# Altium project MAX78000.PrjPcb
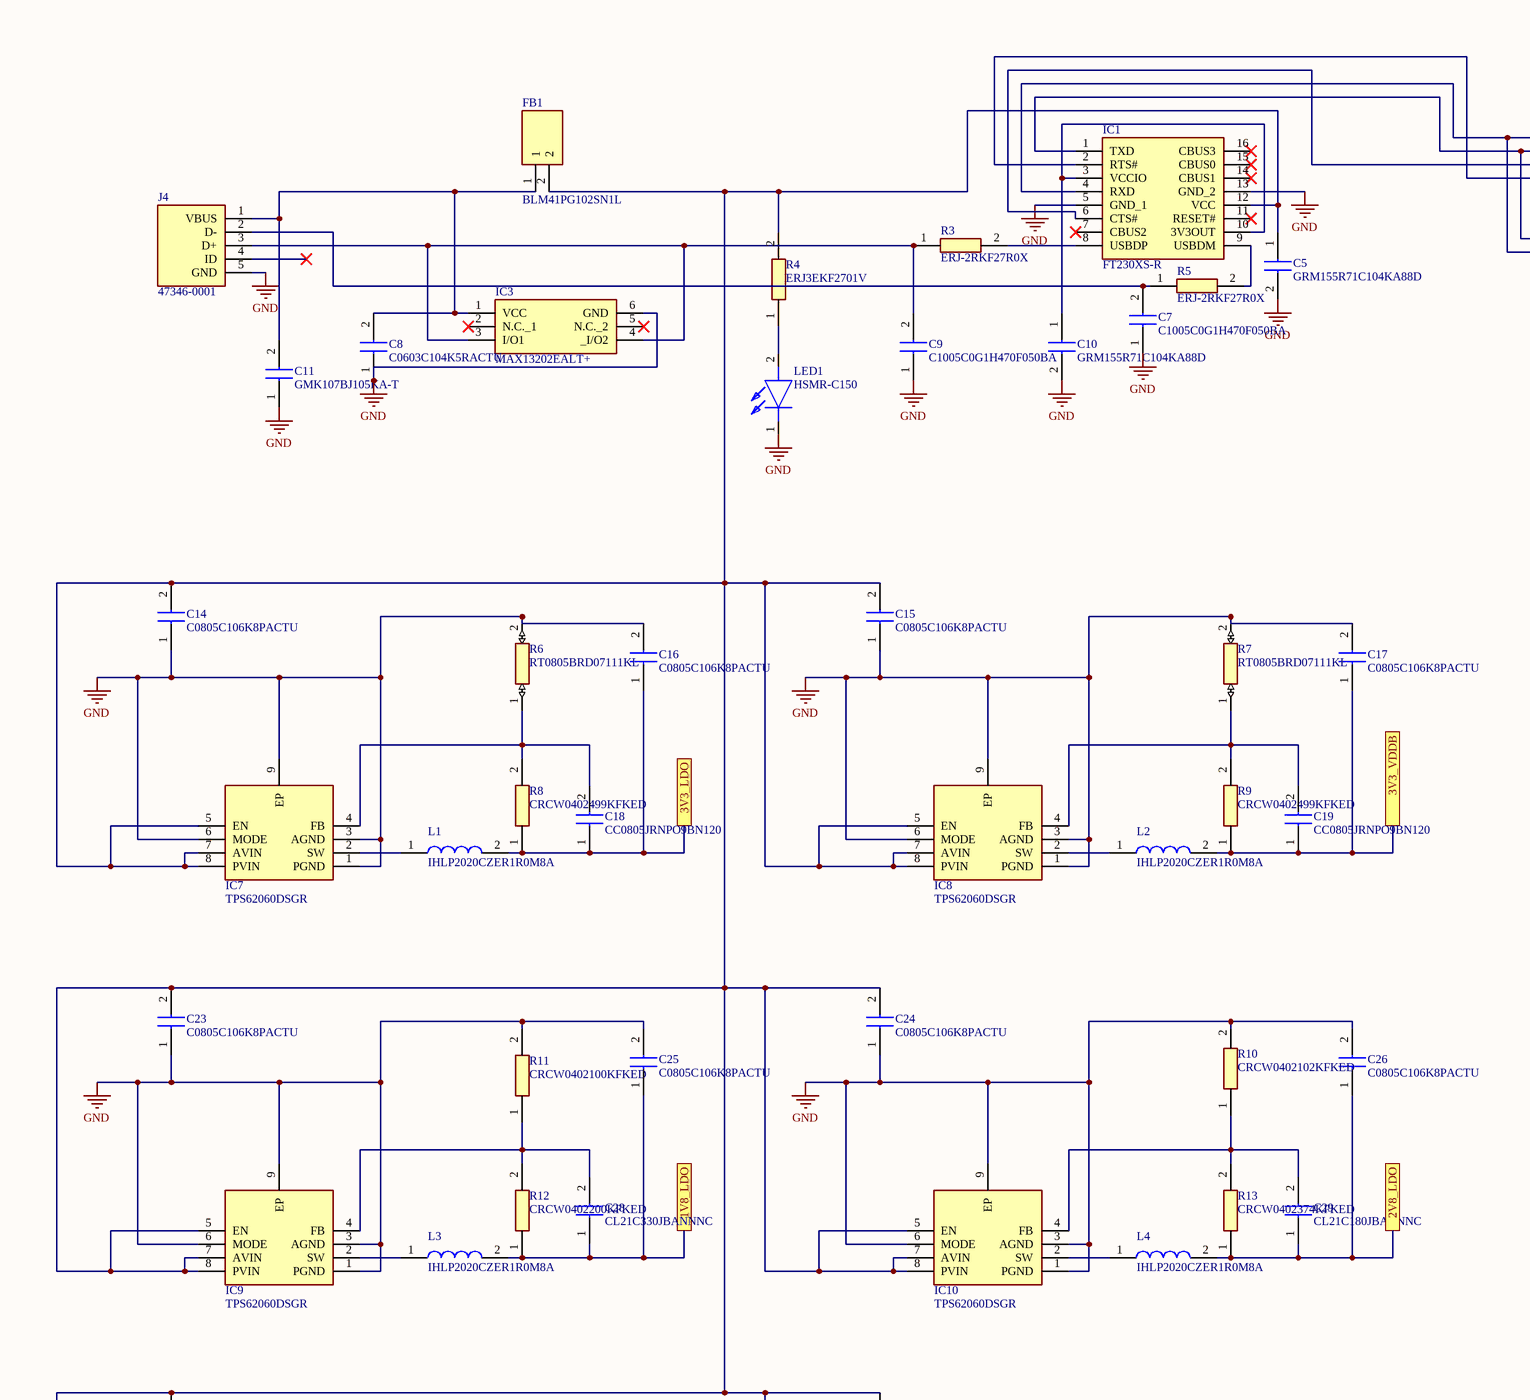
[diagram p0: V1.SchDoc, top left]
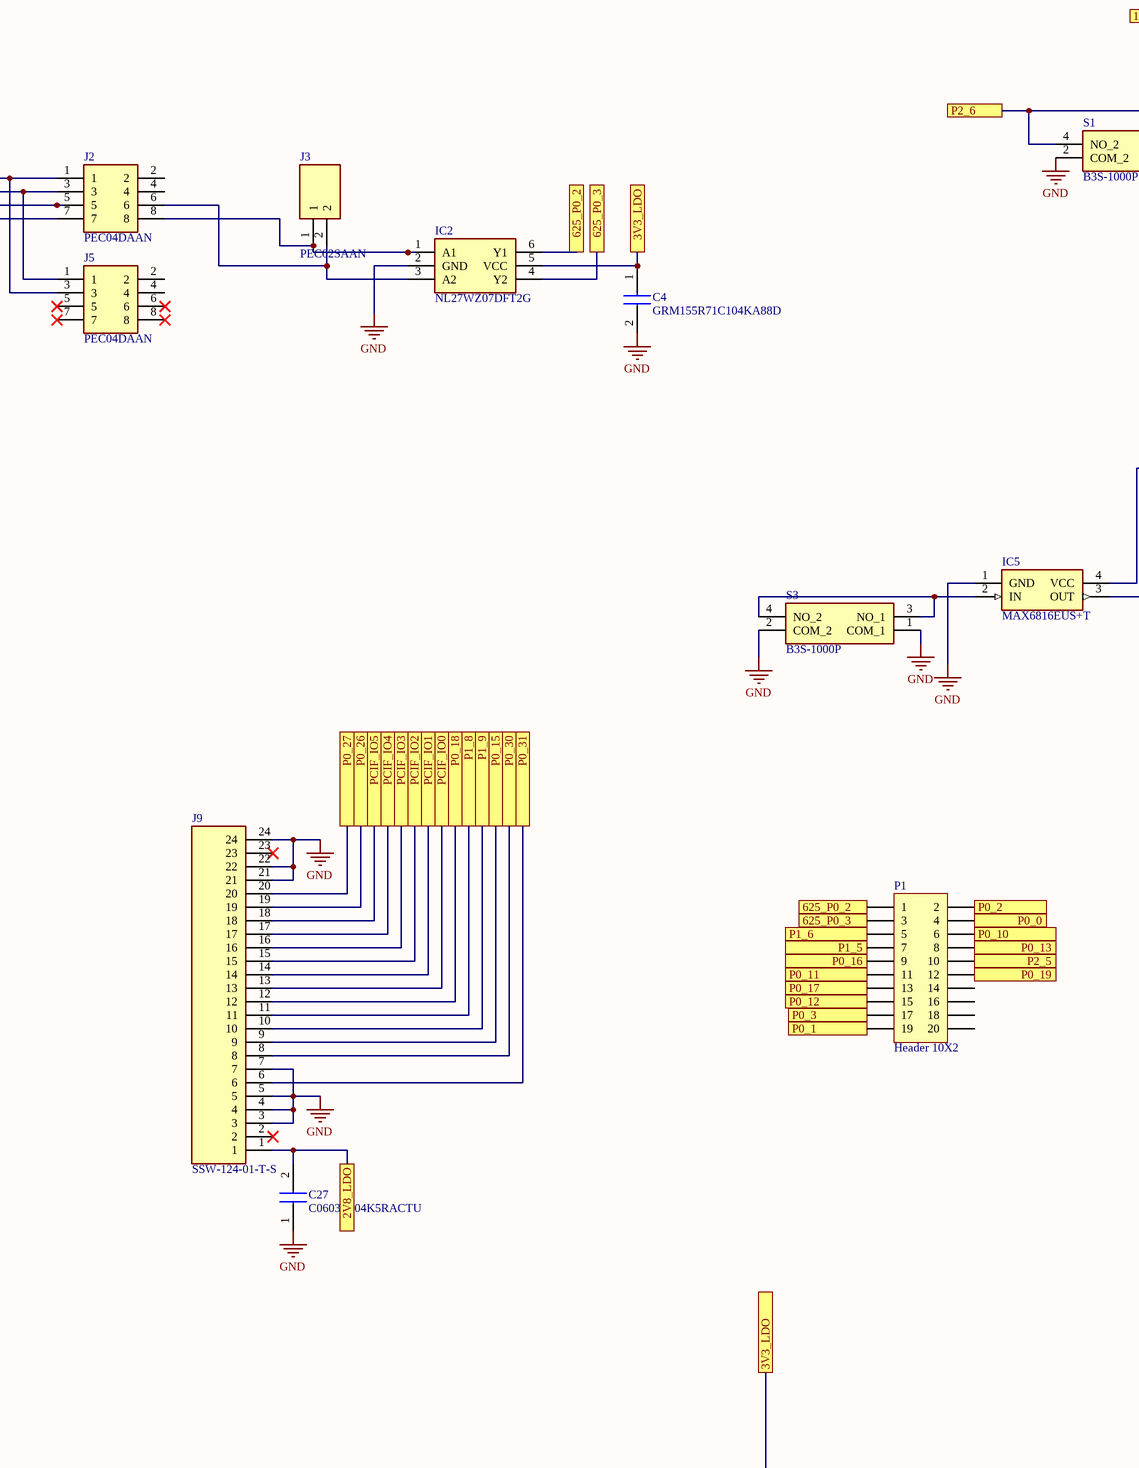
[diagram p1: V1.SchDoc, top middle]
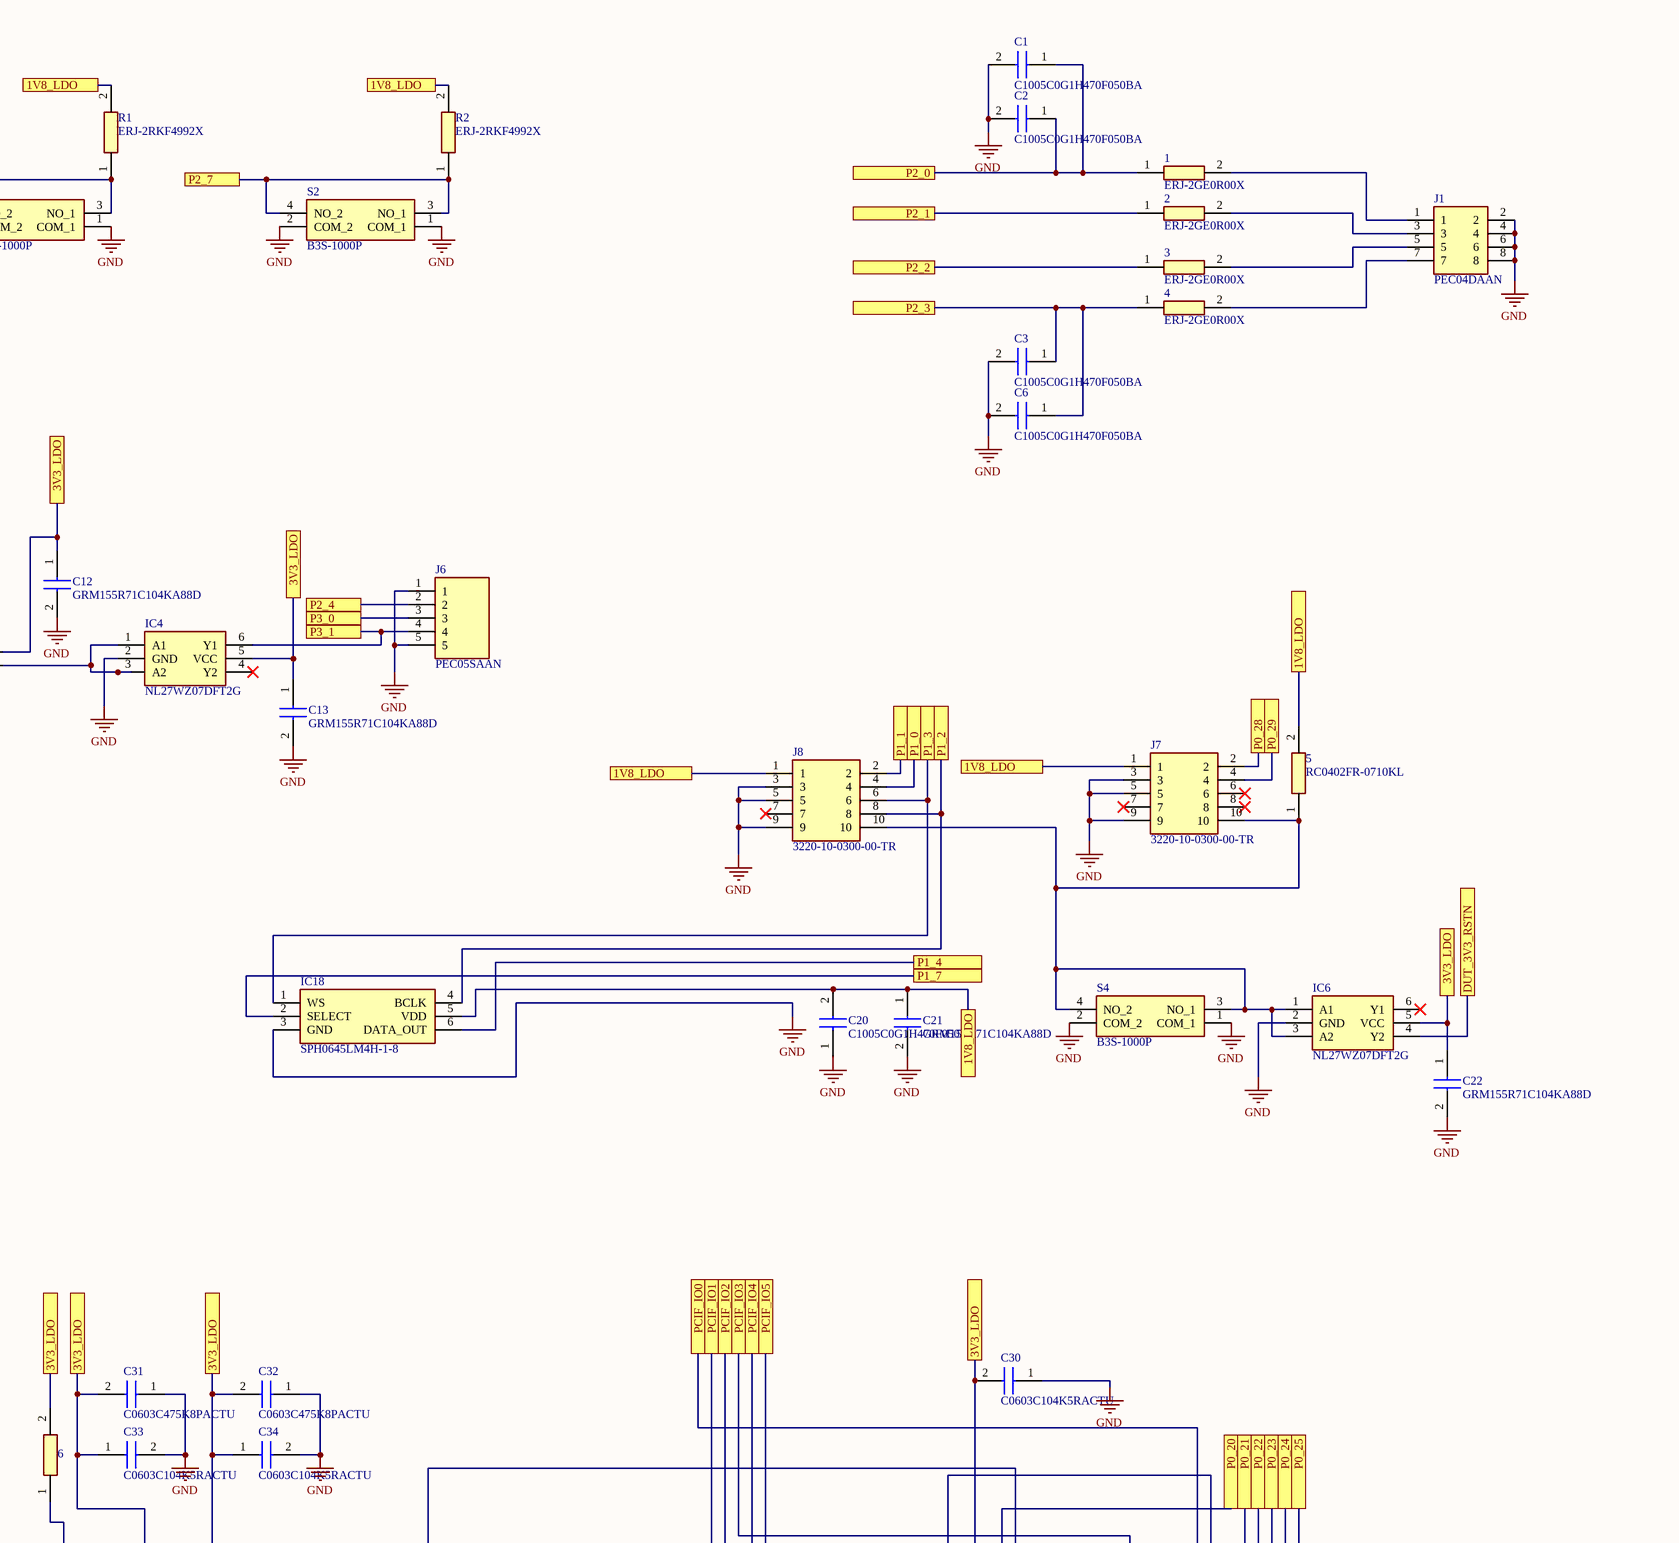
[diagram p2: V1.SchDoc, top right]
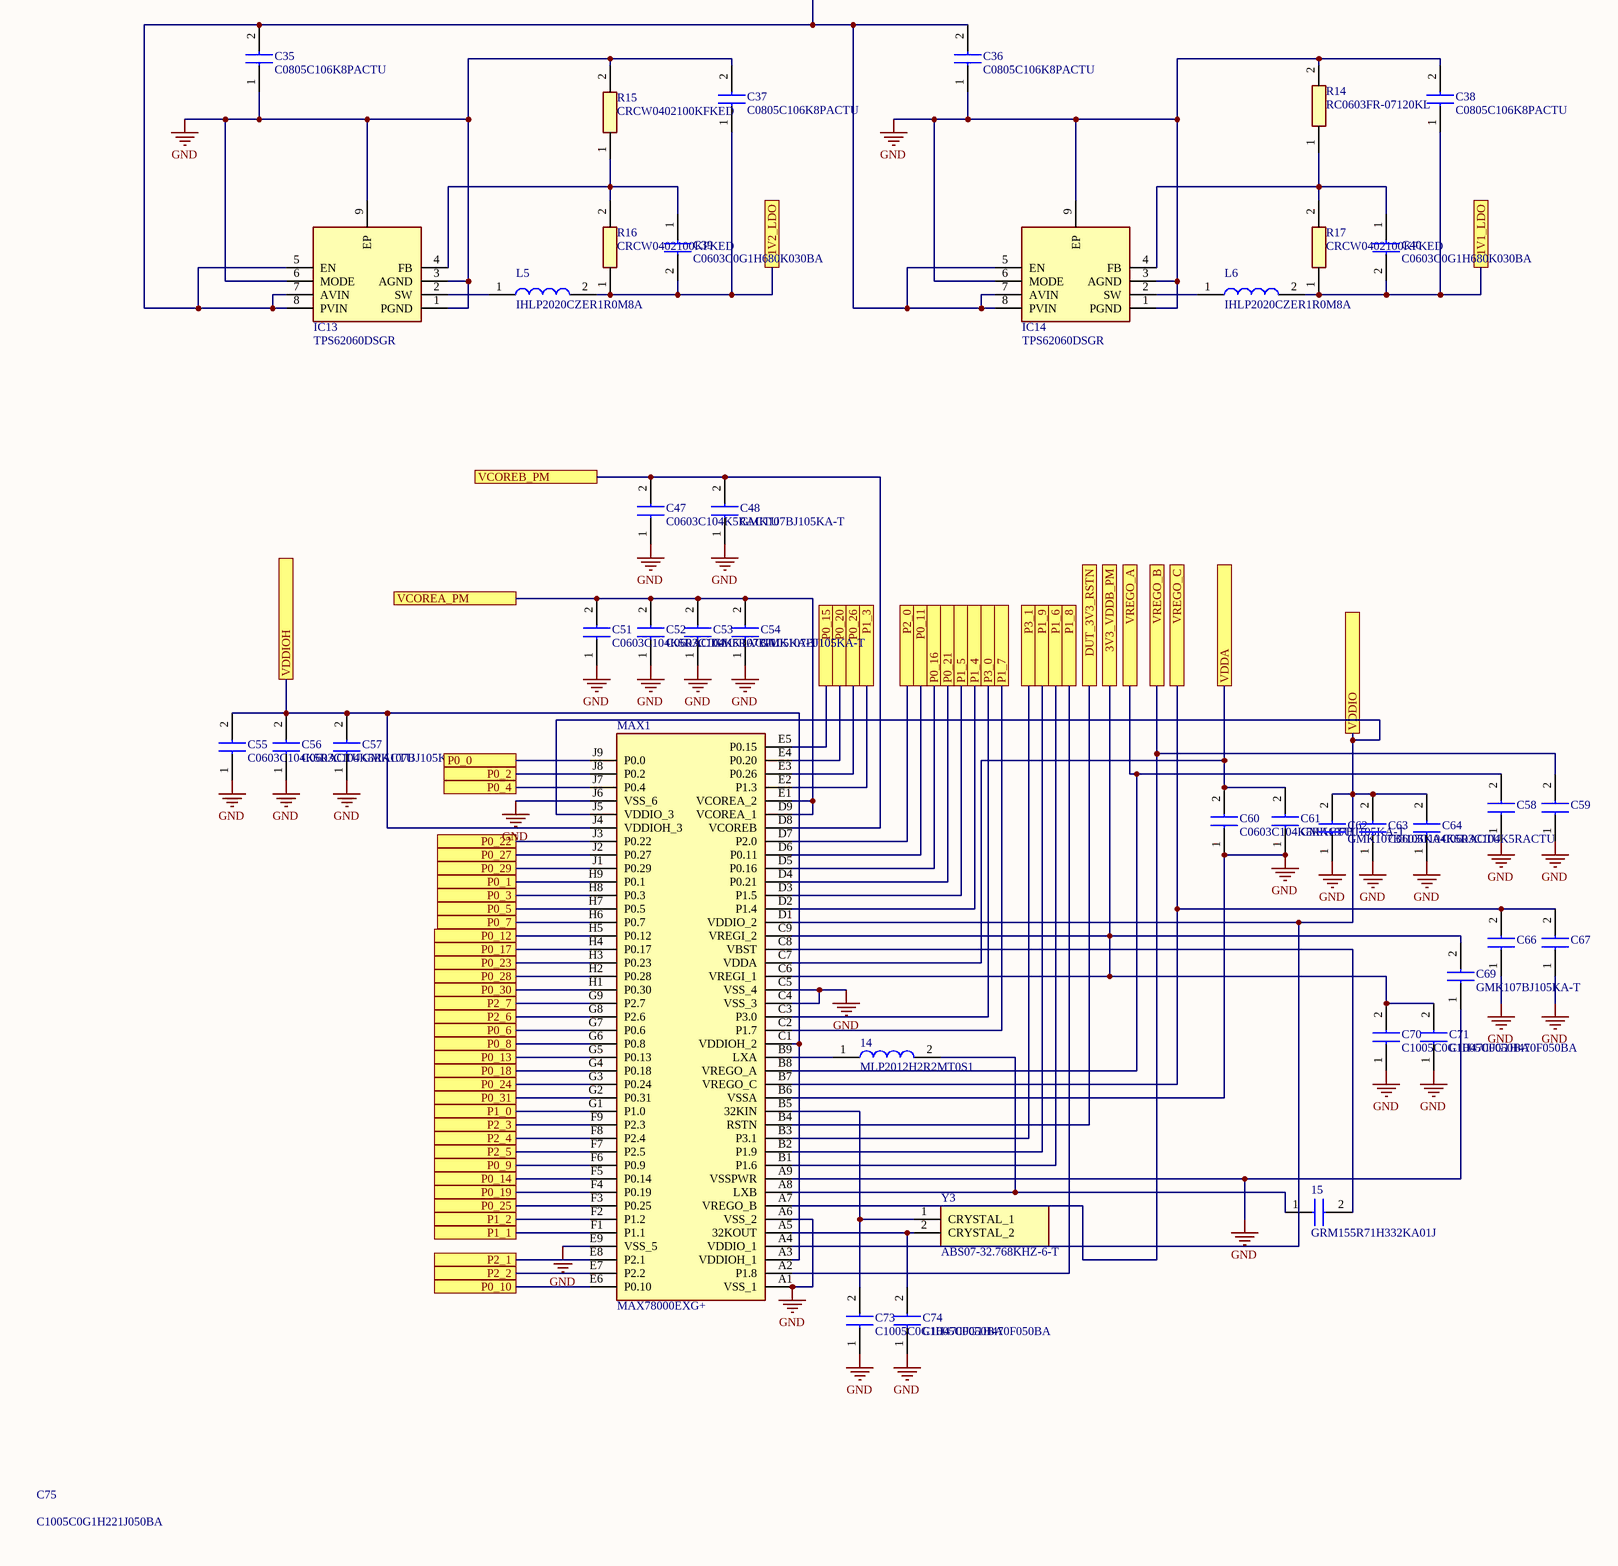
[diagram p3: V1.SchDoc, bottom left]
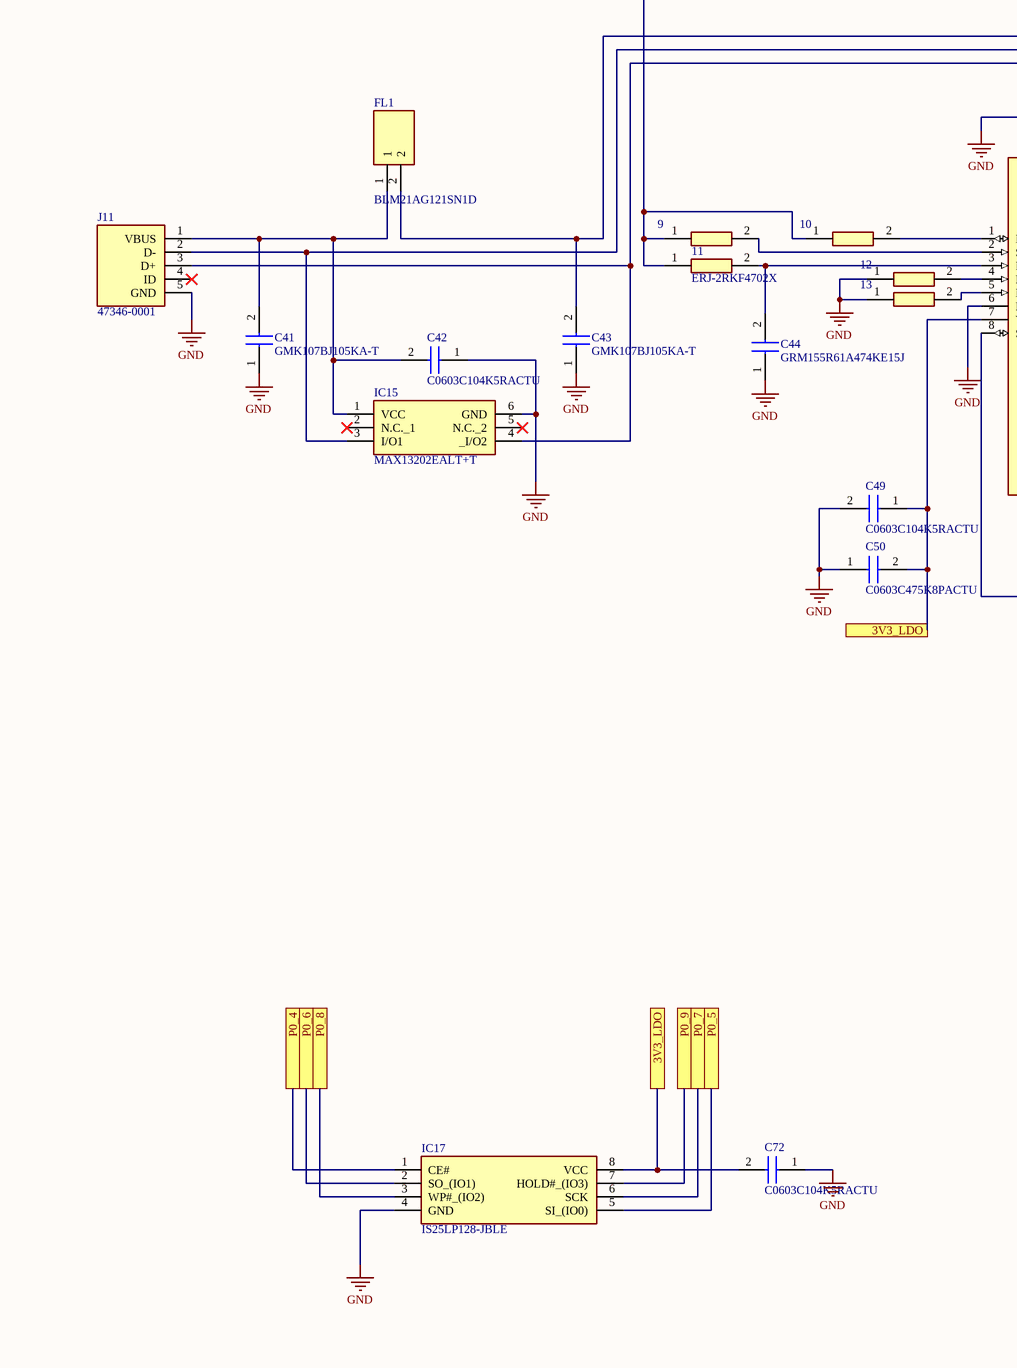
[diagram p4: V1.SchDoc, bottom middle]
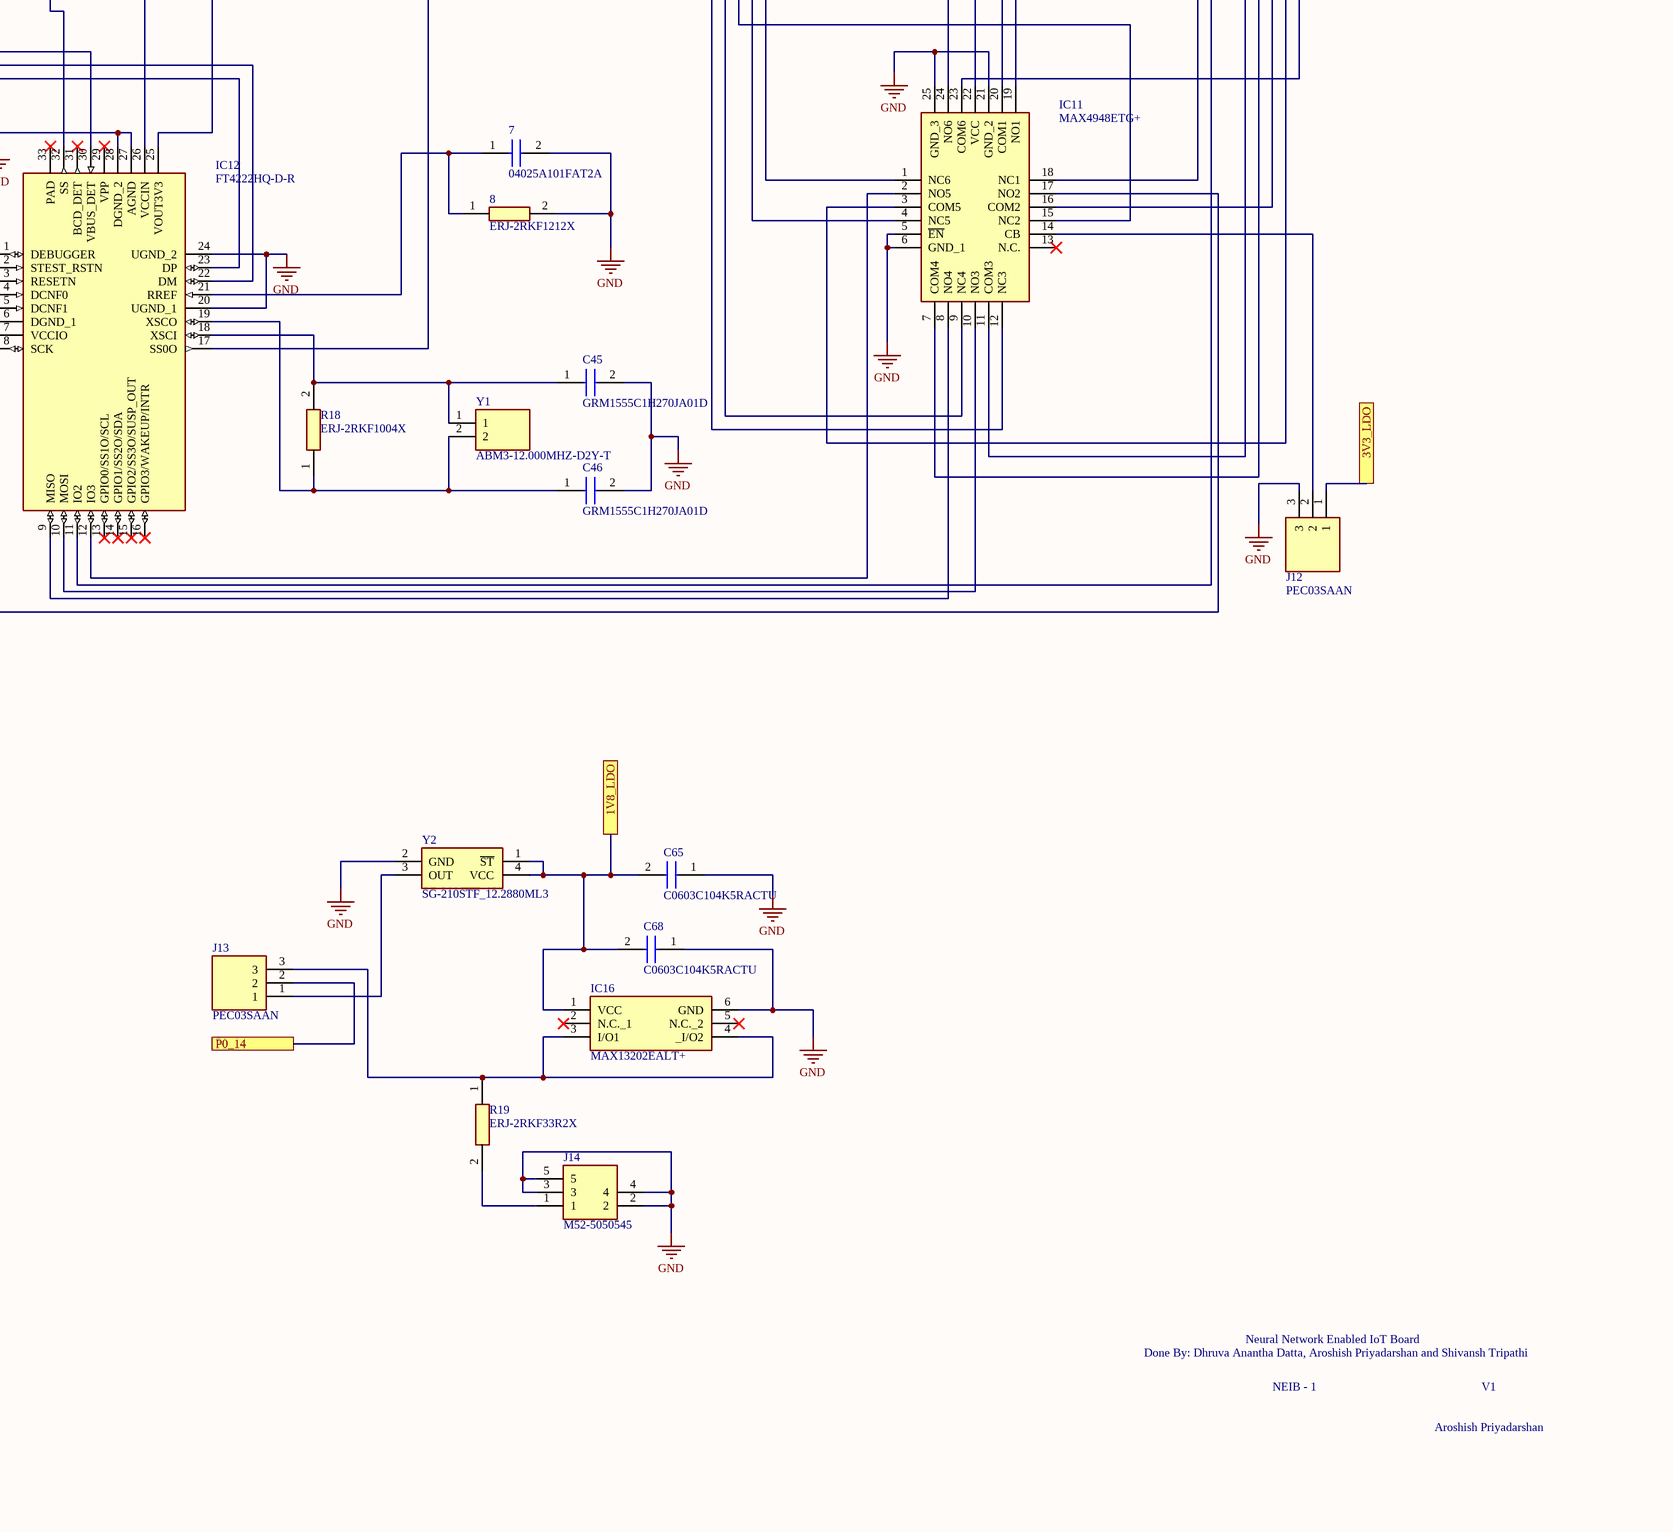
[diagram p5: V1.SchDoc, bottom right]
1 sheet, 158 parts. Net scope: flat (ports and power ports of the same name join across sheets).
Board file: V1.PcbDoc

## Sheet V1.SchDoc
size A1

### Parts
1  ERJ-2GE0R00X  [RESC1005X40N]
2  ERJ-2GE0R00X  [RESC1005X40N]
3  ERJ-2GE0R00X  [RESC1005X40N]
4  ERJ-2GE0R00X  [RESC1005X40N]
5  RC0402FR-0710KL  [RESC1005X40N]
6  RC0402FR-0710KL  [RESC1005X40N]  (value not drawn)
7  04025A101FAT2A  [CAPC1005X56N]
8  ERJ-2RKF1212X  [ERJ2R_(0402)]
9  RC0402FR-0710KL  [RESC1005X40N]  (value not drawn)
10  RC0402FR-0710KL  [RESC1005X40N]  (value not drawn)
11  ERJ-2RKF4702X  [ERJ2R_(0402)]
12  RC0402FR-0710KL  [RESC1005X40N]  (value not drawn)
13  RC0402FR-0710KL  [RESC1005X40N]  (value not drawn)
14  MLP2012H2R2MT0S1  [INDC2012X105N]
15  GRM155R71H332KA01J  [CAPC1005X55N]
C1  C1005C0G1H470F050BA  [C1005_Commercial]
C2  C1005C0G1H470F050BA  [C1005_Commercial]
C3  C1005C0G1H470F050BA  [C1005_Commercial]
C4  GRM155R71C104KA88D  [CAPC1005X55N]
C5  GRM155R71C104KA88D  [CAPC1005X55N]
C6  C1005C0G1H470F050BA  [C1005_Commercial]
C7  C1005C0G1H470F050BA  [C1005_Commercial]
C8  C0603C104K5RACTU  [CAPC1608X95N]
C9  C1005C0G1H470F050BA  [C1005_Commercial]
C10  GRM155R71C104KA88D  [CAPC1005X55N]
C11  GMK107BJ105KA-T  [CAPC1608X90N]
C12  GRM155R71C104KA88D  [CAPC1005X55N]
C13  GRM155R71C104KA88D  [CAPC1005X55N]
C14  C0805C106K8PACTU  [CAPC2012X140N]
C15  C0805C106K8PACTU  [CAPC2012X140N]
C16  C0805C106K8PACTU  [CAPC2012X140N]
C17  C0805C106K8PACTU  [CAPC2012X140N]
C18  CC0805JRNPO9BN120  [CAPC2012X70N]
C19  CC0805JRNPO9BN120  [CAPC2012X70N]
C20  C1005C0G1H470F050BA  [C1005_Commercial]
C21  GRM155R71C104KA88D  [CAPC1005X55N]
C22  GRM155R71C104KA88D  [CAPC1005X55N]
C23  C0805C106K8PACTU  [CAPC2012X140N]
C24  C0805C106K8PACTU  [CAPC2012X140N]
C25  C0805C106K8PACTU  [CAPC2012X140N]
C26  C0805C106K8PACTU  [CAPC2012X140N]
C27  C0603C104K5RACTU  [CAPC1608X95N]
C28  CL21C330JBANNNC  [CAPC2012X75N]
C29  CL21C180JBANNNC  [CAPC2012X135N]
C30  C0603C104K5RACTU  [CAPC1608X95N]
C31  C0603C475K8PACTU  [CAPC1608X85N]
C32  C0603C475K8PACTU  [CAPC1608X85N]
C33  C0603C104K5RACTU  [CAPC1608X95N]
C34  C0603C104K5RACTU  [CAPC1608X95N]
C35  C0805C106K8PACTU  [CAPC2012X140N]
C36  C0805C106K8PACTU  [CAPC2012X140N]
C37  C0805C106K8PACTU  [CAPC2012X140N]
C38  C0805C106K8PACTU  [CAPC2012X140N]
C39  C0603C0G1H680K030BA  [C0603_Commercial]
C40  C0603C0G1H680K030BA  [C0603_Commercial]
C41  GMK107BJ105KA-T  [CAPC1608X90N]
C42  C0603C104K5RACTU  [CAPC1608X95N]
C43  GMK107BJ105KA-T  [CAPC1608X90N]
C44  GRM155R61A474KE15J  [CAPC1005X55N]
C45  GRM1555C1H270JA01D  [CAPC1005X55N]
C46  GRM1555C1H270JA01D  [CAPC1005X55N]
C47  C0603C104K5RACTU  [CAPC1608X95N]
C48  GMK107BJ105KA-T  [CAPC1608X90N]
C49  C0603C104K5RACTU  [CAPC1608X95N]
C50  C0603C475K8PACTU  [CAPC1608X85N]
C51  C0603C104K5RACTU  [CAPC1608X95N]
C52  C0603C104K5RACTU  [CAPC1608X95N]
C53  GMK107BJ105KA-T  [CAPC1608X90N]
C54  GMK107BJ105KA-T  [CAPC1608X90N]
C55  C0603C104K5RACTU  [CAPC1608X95N]
C56  C0603C104K5RACTU  [CAPC1608X95N]
C57  GMK107BJ105KA-T  [CAPC1608X90N]
C58  C1608X5R0J226M080AC  [C1608_Commercial]  (value not drawn)
C59  C1608X5R0J226M080AC  [C1608_Commercial]  (value not drawn)
C60  C0603C104K5RACTU  [CAPC1608X95N]
C61  GMK107BJ105KA-T  [CAPC1608X90N]
C62  GMK107BJ105KA-T  [CAPC1608X90N]
C63  C0603C104K5RACTU  [CAPC1608X95N]
C64  C0603C104K5RACTU  [CAPC1608X95N]
C65  C0603C104K5RACTU  [CAPC1608X95N]
C66  C1608X5R0J226M080AC  [C1608_Commercial]  (value not drawn)
C67  C1608X5R0J226M080AC  [C1608_Commercial]  (value not drawn)
C68  C0603C104K5RACTU  [CAPC1608X95N]
C69  GMK107BJ105KA-T  [CAPC1608X90N]
C70  C1005C0G1H470F050BA  [C1005_Commercial]
C71  C1005C0G1H470F050BA  [C1005_Commercial]
C72  C0603C104K5RACTU  [CAPC1608X95N]
C73  C1005C0G1H470F050BA  [C1005_Commercial]
C74  C1005C0G1H470F050BA  [C1005_Commercial]
C75  C1005C0G1H221J050BA  [C1005_Commercial]
FB1  BLM41PG102SN1L  [BLM41PG102SH1L]
FL1  BLM21AG121SN1D  [BLM21AG102BH1J]
IC1  FT230XS-R  [SOP64P599X175-16N]
IC2  NL27WZ07DFT2G  [SOT65P210X110-6N]
IC3  MAX13202EALT+  [MAX13202EALT]
IC4  NL27WZ07DFT2G  [SOT65P210X110-6N]
IC5  MAX6816EUS+T  [MAX812REUST]
IC6  NL27WZ07DFT2G  [SOT65P210X110-6N]
IC7  TPS62060DSGR  [SON50P200X200X80-9N]
IC8  TPS62060DSGR  [SON50P200X200X80-9N]
IC9  TPS62060DSGR  [SON50P200X200X80-9N]
IC10  TPS62060DSGR  [SON50P200X200X80-9N]
IC11  MAX4948ETG+  [QFN50P400X400X80-25N]
IC12  FT4222HQ-D-R  [QFN50P500X500X90-33N]
IC13  TPS62060DSGR  [SON50P200X200X80-9N]
IC14  TPS62060DSGR  [SON50P200X200X80-9N]
IC15  MAX13202EALT+T  [MAX13202EALTT]
IC16  MAX13202EALT+  [MAX13202EALT]
IC17  IS25LP128-JBLE  [SOIC127P790X216-8N]
IC18  SPH0645LM4H-1-8  [SPH0645LM4H18]
J1  PEC04DAAN  [HDRV8W64P254_2X4_1016X508X838P]
J2  PEC04DAAN  [HDRV8W64P254_2X4_1016X508X838P]
J3  PEC02SAAN  [HDRV2W64P0X254_1X2_508X254X838P]
J4  47346-0001  [usb conn]
J5  PEC04DAAN  [HDRV8W64P254_2X4_1016X508X838P]
J6  PEC05SAAN  [HDRV5W64P0X254_1X5_1270X254X858P]
J7  3220-10-0300-00-TR  [322010030000TR]
J8  3220-10-0300-00-TR  [322010030000TR]
J9  SSW-124-01-T-S  [SAMTEC_SSW-124-01-T-S]
J11  47346-0001  [usb conn]
J12  PEC03SAAN  [HDRV3W64P0X254_1X3_762X254X838P]
J13  PEC03SAAN  [HDRV3W64P0X254_1X3_762X254X838P]
J14  M52-5050545  [M525050545]
L1  IHLP2020CZER1R0M8A  [INDPM5552X300N]
L2  IHLP2020CZER1R0M8A  [INDPM5552X300N]
L3  IHLP2020CZER1R0M8A  [INDPM5552X300N]
L4  IHLP2020CZER1R0M8A  [INDPM5552X300N]
L5  IHLP2020CZER1R0M8A  [INDPM5552X300N]
L6  IHLP2020CZER1R0M8A  [INDPM5552X300N]
LED1  HSMR-C150  [LEDC3216X120N]
MAX1  MAX78000EXG+  [max78000]
P1  Header 10X2  [HDR2X10]
R1  ERJ-2RKF4992X  [ERJ2R_(0402)]
R2  ERJ-2RKF4992X  [ERJ2R_(0402)]
R3  ERJ-2RKF27R0X  [ERJ2R_(0402)]
R4  ERJ3EKF2701V  [ERJ3EK_(0603)]
R5  ERJ-2RKF27R0X  [ERJ2R_(0402)]
R6  RT0805BRD07111KL  [RESC2012X60N]
R7  RT0805BRD07111KL  [RESC2012X60N]
R8  CRCW0402499KFKED  [RESC1005X40N]
R9  CRCW0402499KFKED  [RESC1005X40N]
R10  CRCW0402102KFKED  [RESC1005X40N]
R11  CRCW0402100KFKED  [RESC1005X40N]
R12  CRCW0402200KFKED  [RESC1005X40N]
R13  CRCW0402374KFKED  [RESC1005X40N]
R14  RC0603FR-07120KL  [RESC1608X55N]
R15  CRCW0402100KFKED  [RESC1005X40N]
R16  CRCW0402100KFKED  [RESC1005X40N]
R17  CRCW0402100KFKED  [RESC1005X40N]
R18  ERJ-2RKF1004X  [ERJ2R_(0402)]
R19  ERJ-2RKF33R2X  [ERJ2R_(0402)]
S1  B3S-1000P  [B3S1000P]
S2  B3S-1000P  [B3S1000P]
S3  B3S-1000P  [B3S1000P]
S4  B3S-1000P  [B3S1000P]
Y1  ABM3-12.000MHZ-D2Y-T  [ABM38000MHzD2YT]
Y2  SG-210STF_12.2880ML3  [SG210STF122880ML3]
Y3  ABS07-32.768KHZ-6-T  [ABS0732768KHZ6T]

### Ports
1V1_LDO, 1V2_LDO, 1V8_LDO, 2V8_LDO, 3V3_LDO, 3V3_VDDB, 3V3_VDDB_PM, 625_P0_2, 625_P0_3, DUT_3V3_RSTN, P0_0, P0_1, P0_2, P0_3, P0_4, P0_5, P0_6, P0_7, P0_8, P0_9, P0_10, P0_11, P0_12, P0_13, P0_14, P0_15, P0_16, P0_17, P0_18, P0_19, P0_20, P0_21, P0_22, P0_23, P0_24, P0_25, P0_26, P0_27, P0_28, P0_29, P0_30, P0_31, P1_0, P1_1, P1_2, P1_3, P1_4, P1_5, P1_6, P1_7, P1_8, P1_9, P2_0, P2_1, P2_2, P2_3, P2_4, P2_5, P2_6, P2_7, P3_0, P3_1, PCIF_IO0, PCIF_IO1, PCIF_IO2, PCIF_IO3, PCIF_IO4, PCIF_IO5, VCOREA_PM, VCOREB_PM, VDDA, VDDIO, VDDIOH, VREGO_A, VREGO_B, VREGO_C

### Nets
GND: 7.2 8.2 12.1 13.1 C1.2 C2.2 C3.2 C4.2 C5.2 C6.2 C7.1 C8.1 C9.1 C10.2 C11.1 C12.2 C13.2 C14.1 C15.1 C16.2 C17.2 C20.1 C21.2 C22.2 C23.1 C24.1 C25.2 C26.2 C27.1 C30.1 C31.1(C1) C32.1(C1) C33.2 C34.2 C35.1 C36.1 C37.2 C38.2 C41.1 C42.1 C43.1 C44.1 C45.2 C46.2 C47.1 C48.1 C49.2 C50.1(C1) C51.1 C52.1 C53.1 C54.1 C55.1 C56.1 C57.1 C58.1 C59.1 C60.1 C61.1 C62.1 C63.1 C64.1 C65.1 C66.1 C67.1 C68.1 C69.1 C70.1 C71.1 C72.1 C73.1 C74.1 IC1.5(GND_1) IC1.13(GND_2) IC2.2(GND) IC3.6(GND) IC4.2(GND) IC5.1(GND) IC6.2(GND) IC7.1(PGND) IC7.3(AGND) IC7.6(MODE) IC7.9(EP) IC8.1(PGND) IC8.3(AGND) IC8.6(MODE) IC8.9(EP) IC9.1(PGND) IC9.3(AGND) IC9.6(MODE) IC9.9(EP) IC10.1(PGND) IC10.3(AGND) IC10.6(MODE) IC10.9(EP) IC11.5(~{EN}) IC11.6(GND_1) IC11.21(GND_2) IC11.25(GND_3) IC12.6(DGND_1) IC12.20(UGND_1) IC12.24(UGND_2) IC12.27(AGND) IC12.28(DGND_2) IC13.1(PGND) IC13.3(AGND) IC13.6(MODE) IC13.9(EP) IC14.1(PGND) IC14.3(AGND) IC14.6(MODE) IC14.9(EP) IC15.6(GND) IC16.6(GND) IC17.4(GND) IC18.3(GND) J1.2 J1.4 J1.6 J1.8 J4.5(GND) J6.1 J6.5 J7.3 J7.5 J7.9 J8.3 J8.5 J8.9 J9.3 J9.4 J9.5 J9.7 J9.21 J9.22 J9.24 J11.5(GND) J12.3 J14.2 J14.3 J14.4 J14.5 LED1.1(K) MAX1.A1(VSS_1) MAX1.A6(VSS_2) MAX1.A9(VSSPWR) MAX1.B6(VSSA) MAX1.C4(VSS_3) MAX1.C5(VSS_4) MAX1.E9(VSS_5) MAX1.J6(VSS_6) R6.2 R7.2 R10.2 R11.2 R14.2 R15.2 S1.1(COM_1) S1.2(COM_2) S2.1(COM_1) S2.2(COM_2) S3.1(COM_1) S3.2(COM_2) S4.1(COM_1) S4.2(COM_2) Y2.2(GND)
Net1_1: 1.1 C1.1 C2.1 MAX1.D7(P2.0) ; port P2_0
Net1_2: 1.2 J1.1
Net2_1: 2.1 MAX1.E8(P2.1) ; port P2_1
Net2_2: 2.2 J1.3
Net3_1: 3.1 MAX1.E7(P2.2) ; port P2_2
Net3_2: 3.2 J1.5
Net4_1: 4.1 C3.1 C6.1 MAX1.F9(P2.3) ; port P2_3
Net4_2: 4.2 J1.7
Net5_1: 5.1 IC6.1(A1) IC6.3(A2) J7.10 J8.10 S4.3(NO_1) S4.4(NO_2)
Net5_2: 5.2 C20.2 C21.1 C25.1 C28.1 C65.2 C68.2 IC16.1(VCC) IC18.5(VDD) J7.1 J8.1 L3.2 R1.2 R2.2 R12.1 Y2.1(~{ST}) Y2.4(VCC) ; port 1V8_LDO
Net6_1: 6.1 IC12.32(SS)
Net6_2: 6.2 9.1 10.1 11.1 C4.1 C12.1 C13.1 C16.1 C18.1 C22.1 C30.2 C31.2(C2) C32.2(C2) C33.1 C34.1 C49.1 C50.2(C2) C72.2 IC2.5(VCC) IC4.5(VCC) IC5.4(VCC) IC6.5(VCC) IC11.22(VCC) IC12.7(VCCIO) IC12.25(VOUT3V3) IC12.26(VCCIN) IC17.8(VCC) J12.1 L1.2 R8.1 ; port 3V3_LDO
Net7_1: 7.1 8.1 IC12.21(RREF)
Net9_2: 9.2 IC12.2(STEST_RSTN)
Net10_2: 10.2 IC12.1(DEBUGGER)
Net11_2: 11.2 C44.2 IC12.3(RESETN)
Net12_2: 12.2 IC12.4(DCNF0)
Net13_2: 13.2 IC12.5(DCNF1)
Net14_1: 14.1 MAX1.B9(LXA)
Net14_2: 14.2 15.1 MAX1.A8(LXB)
Net15_2: 15.2 MAX1.C8(VBST)
NetC5_1: C5.1 C14.2 C15.2 C23.2 C24.2 C35.2 C36.2 FB1.2 IC1.12(VCC) IC7.5(EN) IC7.7(AVIN) IC7.8(PVIN) IC8.5(EN) IC8.7(AVIN) IC8.8(PVIN) IC9.5(EN) IC9.7(AVIN) IC9.8(PVIN) IC10.5(EN) IC10.7(AVIN) IC10.8(PVIN) IC13.5(EN) IC13.7(AVIN) IC13.8(PVIN) IC14.5(EN) IC14.7(AVIN) IC14.8(PVIN) R4.2
NetC7_2: C7.2 J4.2(D-) R5.1
NetC8_2: C8.2 C11.2 FB1.1 IC3.1(VCC) J4.1(VBUS)
NetC9_2: C9.2 IC3.3(I/O1) IC3.4(_I/O2) J4.3(D+) R3.1
NetC10_1: C10.1 IC1.3(VCCIO) IC1.10(3V3OUT)
NetC17_1: C17.1 C19.1 L2.2 R9.1 ; port 3V3_VDDB
NetC18_2: C18.2 IC7.4(FB) R6.1 R8.2
NetC19_2: C19.2 IC8.4(FB) R7.1 R9.2
NetC26_1: C26.1 C27.2 C29.1 J9.1 L4.2 R13.1 ; port 2V8_LDO
NetC28_2: C28.2 IC9.4(FB) R11.1 R12.2
NetC29_2: C29.2 IC10.4(FB) R10.1 R13.2
NetC37_1: C37.1 C39.2 L5.2 R16.1 ; port 1V2_LDO
NetC38_1: C38.1 C40.2 L6.2 R17.1 ; port 1V1_LDO
NetC39_1: C39.1 IC13.4(FB) R15.1 R16.2
NetC40_1: C40.1 IC14.4(FB) R14.1 R17.2
NetC41_2: C41.2 C42.2 FL1.1 IC15.1(VCC) J11.1(VBUS)
NetC43_2: C43.2 FL1.2 IC12.30(VBUS_DET)
NetC45_1: C45.1 IC12.18(XSCI) R18.2 Y1.1
NetC46_1: C46.1 IC12.19(XSCO) R18.1 Y1.2
NetC47_2: C47.2 C48.2 MAX1.D8(VCOREB) ; port VCOREB_PM
NetC51_2: C51.2 C52.2 C53.2 C54.2 MAX1.D9(VCOREA_1) MAX1.E1(VCOREA_2) ; port VCOREA_PM
NetC55_2: C55.2 C56.2 C57.2 MAX1.A3(VDDIOH_1) MAX1.C1(VDDIOH_2) MAX1.J4(VDDIOH_3) ; port VDDIOH
NetC58_2: C58.2 MAX1.B8(VREGO_A) ; port VREGO_A
NetC59_2: C59.2 MAX1.A7(VREGO_B) ; port VREGO_B
NetC60_2: C60.2 C61.2 MAX1.C7(VDDA) ; port VDDA
NetC62_2: C62.2 C63.2 C64.2 MAX1.A4(VDDIO_1) MAX1.D1(VDDIO_2) MAX1.J5(VDDIO_3) ; port VDDIO
NetC66_2: C66.2 C67.2 MAX1.B7(VREGO_C) ; port VREGO_C
NetC69_2: C69.2 C70.2 C71.2 MAX1.C6(VREGI_1) MAX1.C9(VREGI_2) ; port 3V3_VDDB_PM
NetC73_2: C73.2 MAX1.B5(32KIN) Y3.1(CRYSTAL_1)
NetC74_2: C74.2 MAX1.A5(32KOUT) Y3.2(CRYSTAL_2)
NetIC1_1: IC1.1(TXD) J2.3 J5.1
NetIC1_2: IC1.2(RTS#) J2.7
NetIC1_4: IC1.4(RXD) J2.1 J5.3
NetIC1_6: IC1.6(CTS#) J2.5
NetIC1_8: IC1.8(USBDP) R3.2
NetIC1_9: IC1.9(USBDM) R5.2
NetIC2_1: IC2.1(A1) J2.8 J3.1
NetIC2_3: IC2.3(A2) J2.6 J3.2
NetIC2_4: IC2.4(Y2) P1.3 ; port 625_P0_3
NetIC2_6: IC2.6(Y1) P1.1 ; port 625_P0_2
NetIC4_1: IC4.1(A1) IC4.3(A2) IC5.3(OUT)
NetIC4_6: IC4.6(Y1) J6.4 MAX1.B3(P3.1) ; port P3_1
NetIC5_2: IC5.2(IN) S3.3(NO_1) S3.4(NO_2)
NetIC6_4: IC6.4(Y2) MAX1.B4(RSTN) ; port DUT_3V3_RSTN
NetIC7_2: IC7.2(SW) L1.1
NetIC8_2: IC8.2(SW) L2.1
NetIC9_2: IC9.2(SW) L3.1
NetIC10_2: IC10.2(SW) L4.1
NetIC11_1: IC11.1(NC6) J9.18 ; port PCIF_IO5
NetIC11_2: IC11.2(NO5) IC12.12(IO3)
NetIC11_3: IC11.3(COM5) MAX1.G3(P0.24) ; port P0_24
NetIC11_4: IC11.4(NC5) J9.17 ; port PCIF_IO4
NetIC11_7: IC11.7(COM4) MAX1.J3(P0.22) ; port P0_22
NetIC11_8: IC11.8(NO4) IC12.9(MISO)
NetIC11_9: IC11.9(NC4) J9.15 ; port PCIF_IO2
NetIC11_10: IC11.10(NO3) IC12.10(MOSI)
NetIC11_11: IC11.11(COM3) MAX1.D4(P0.21) ; port P0_21
NetIC11_12: IC11.12(NC3) J9.14 ; port PCIF_IO1
NetIC11_14: IC11.14(CB) J12.2
NetIC11_15: IC11.15(NC2) J9.16 ; port PCIF_IO3
NetIC11_16: IC11.16(COM2) MAX1.H3(P0.23) ; port P0_23
NetIC11_17: IC11.17(NO2) IC12.8(SCK)
NetIC11_18: IC11.18(NC1) J9.13 ; port PCIF_IO0
NetIC11_19: IC11.19(NO1) IC12.17(SS0O)
NetIC11_20: IC11.20(COM1) MAX1.E4(P0.20) ; port P0_20
NetIC11_23: IC11.23(COM6) MAX1.F3(P0.25) ; port P0_25
NetIC11_24: IC11.24(NO6) IC12.11(IO2)
NetIC12_22: IC12.22(DM) IC15.3(I/O1) J11.2(D-)
NetIC12_23: IC12.23(DP) IC15.4(_I/O2) J11.3(D+)
NetIC13_2: IC13.2(SW) L5.1
NetIC14_2: IC14.2(SW) L6.1
NetIC16_3: IC16.3(I/O1) IC16.4(_I/O2) J13.3 R19.1
NetIC17_1: IC17.1(CE#) MAX1.J7(P0.4) ; port P0_4
NetIC17_2: IC17.2(SO_(IO1)) MAX1.G7(P0.6) ; port P0_6
NetIC17_3: IC17.3(WP#_(IO2)) MAX1.G6(P0.8) ; port P0_8
NetIC17_5: IC17.5(SI_(IO0)) MAX1.H7(P0.5) ; port P0_5
NetIC17_6: IC17.6(SCK) MAX1.H6(P0.7) ; port P0_7
NetIC17_7: IC17.7(HOLD#_(IO3)) MAX1.F6(P0.9) ; port P0_9
NetIC18_1: IC18.1(WS) J8.6 MAX1.E2(P1.3) ; port P1_3
NetIC18_2: IC18.2(SELECT) MAX1.C2(P1.7) ; port P1_7
NetIC18_4: IC18.4(BCLK) J8.8 MAX1.F2(P1.2) ; port P1_2
NetIC18_6: IC18.6(DATA_OUT) MAX1.D2(P1.4) ; port P1_4
NetJ6_2: J6.2 MAX1.F8(P2.4) ; port P2_4
NetJ6_3: J6.3 MAX1.C3(P3.0) ; port P3_0
NetJ7_2: J7.2 MAX1.H2(P0.28) ; port P0_28
NetJ7_4: J7.4 MAX1.J1(P0.29) ; port P0_29
NetJ8_2: J8.2 MAX1.F1(P1.1) ; port P1_1
NetJ8_4: J8.4 MAX1.G1(P1.0) ; port P1_0
NetJ9_6: J9.6 MAX1.G2(P0.31) ; port P0_31
NetJ9_8: J9.8 MAX1.H1(P0.30) ; port P0_30
NetJ9_9: J9.9 MAX1.E5(P0.15) ; port P0_15
NetJ9_10: J9.10 MAX1.B2(P1.9) ; port P1_9
NetJ9_11: J9.11 MAX1.A2(P1.8) ; port P1_8
NetJ9_12: J9.12 MAX1.G4(P0.18) ; port P0_18
NetJ9_19: J9.19 MAX1.E3(P0.26) ; port P0_26
NetJ9_20: J9.20 MAX1.J2(P0.27) ; port P0_27
NetJ13_1: J13.1 Y2.3(OUT)
NetJ13_2: J13.2 MAX1.F5(P0.14) ; port P0_14
NetJ14_1: J14.1 R19.2
NetLED1_2: LED1.2(A) R4.1
NetMAX1_B1: MAX1.B1(P1.6) P1.5 ; port P1_6
NetMAX1_D3: MAX1.D3(P1.5) P1.7 ; port P1_5
NetMAX1_D5: MAX1.D5(P0.16) P1.9 ; port P0_16
NetMAX1_D6: MAX1.D6(P0.11) P1.11 ; port P0_11
NetMAX1_E6: MAX1.E6(P0.10) P1.6 ; port P0_10
NetMAX1_F4: MAX1.F4(P0.19) P1.12 ; port P0_19
NetMAX1_F7: MAX1.F7(P2.5) P1.10 ; port P2_5
NetMAX1_G5: MAX1.G5(P0.13) P1.8 ; port P0_13
NetMAX1_G8: MAX1.G8(P2.6) R1.1 S1.3(NO_1) S1.4(NO_2) ; port P2_6
NetMAX1_G9: MAX1.G9(P2.7) R2.1 S2.3(NO_1) S2.4(NO_2) ; port P2_7
NetMAX1_H4: MAX1.H4(P0.17) P1.13 ; port P0_17
NetMAX1_H5: MAX1.H5(P0.12) P1.15 ; port P0_12
NetMAX1_H8: MAX1.H8(P0.3) P1.17 ; port P0_3
NetMAX1_H9: MAX1.H9(P0.1) P1.19 ; port P0_1
NetMAX1_J8: MAX1.J8(P0.2) P1.2 ; port P0_2
NetMAX1_J9: MAX1.J9(P0.0) P1.4 ; port P0_0

Not connected (* = marked no-connect by the designer): IC1 7(CBUS2)* 11(RESET#)* 14(CBUS1)* 15(CBUS0)* 16(CBUS3)*; IC3 2(N.C._1)* 5(N.C._2)*; IC4 4(Y2)*; IC6 6(Y1)*; IC11 13(N.C.)*; IC12 13(GPIO0/SS1O/SCL)* 14(GPIO1/SS2O/SDA)* 15(GPIO2/SS3O/SUSP_OUT)* 16(GPIO3/WAKEUP/INTR)* 29(VPP)* 31(BCD_DET)* 33(PAD)*; IC15 2(N.C._1)* 5(N.C._2)*; IC16 2(N.C._1)* 5(N.C._2)*; J2 2 4; J4 4(ID)*; J5 2 4 5* 6* 7* 8*; J7 6* 7* 8*; J8 7*; J9 2* 23*; J11 4(ID)*; P1 14 16 18 20

### Notes on the sheet
- Done By: Dhruva Anantha Datta, Aroshish Priyadarshan and Shivansh Tripathi
- Neural Network Enabled IoT Board
- NEIB - 1
- Aroshish Priyadarshan
- V1

### Library data of the parts
1-4 = ERJ-2GE0R00X: Resistor; Manufacturer_Name: Panasonic; Datasheet Link: http://industrial.panasonic.com/www-cgi/jvcr13pz.cgi?E+PZ+3+AOA0001+ERJ2GE0R00X+7+WW; Height: 0.4mm; Manufacturer_Part_Number: ERJ-2GE0R00X; Mouser Part Number: 667-ERJ-2GE0R00X; Mouser Price/Stock: https://www.mouser.co.uk/ProductDetail/Panasonic/ERJ-2GE0R00X?qs=Cz%252B5TvT4yly5%252BP7oLZcLxw%3D%3D; Arrow Part Number: ERJ-2GE0R00X; Arrow Price/Stock: https://www.arrow.com/en/products/erj2ge0r00x/panasonic
5 6 9 10 12 13 = RC0402FR-0710KL: Resistor; Manufacturer_Name: YAGEO (PHYCOMP); Datasheet Link: https://datasheet.datasheetarchive.com/originals/distributors/Datasheets_SAMA/902f9e387b938f871d31120f5fc1d65e.pdf; Height: 0.4mm; Manufacturer_Part_Number: RC0402FR-0710KL; Mouser Part Number: 603-RC0402FR-0710KL; Mouser Price/Stock: https://www.mouser.co.uk/ProductDetail/YAGEO/RC0402FR-0710KL?qs=I1mnnYJTTsxUoNwrUsQExA%3D%3D; Arrow Part Number: RC0402FR-0710KL; Arrow Price/Stock: https://www.arrow.com/en/products/rc0402fr-0710kl/yageo
7 = 04025A101FAT2A: Capacitor; Manufacturer_Name: AVX; Datasheet Link: http://www.mouser.com/catalog/supplier/library/pdf/AVXSurfaceMountCeramic.pdf; Height: 0.56mm; Manufacturer_Part_Number: 04025A101FAT2A; Mouser Part Number: 581-04025A101F; Mouser Price/Stock: https://www.mouser.co.uk/ProductDetail/AVX/04025A101FAT2A?qs=MeUoP7zHHrXw8ucaKHqBUA%3D%3D; Arrow Part Number: 04025A101FAT2A; Arrow Price/Stock: https://www.arrow.com/en/products/04025a101fat2a/avx
8 = ERJ-2RKF1212X: Resistor; Manufacturer_Name: Panasonic; Datasheet Link: http://industrial.panasonic.com/cdbs/www-data/pdf/RDA0000/AOA0000C304.pdf; Height: 0.4mm; Manufacturer_Part_Number: ERJ-2RKF1212X; Mouser Part Number: 667-ERJ-2RKF1212X; Mouser Price/Stock: https://www.mouser.co.uk/ProductDetail/Panasonic/ERJ-2RKF1212X?qs=MVjVSMjNRMoqfjL0Oti%252BUw%3D%3D
11 = ERJ-2RKF4702X: Resistor; Manufacturer_Name: Panasonic; Datasheet Link: http://industrial.panasonic.com/cdbs/www-data/pdf/RDA0000/AOA0000C304.pdf; Height: 0.4mm; Manufacturer_Part_Number: ERJ-2RKF4702X; Mouser Part Number: 667-ERJ-2RKF4702X; Mouser Price/Stock: https://www.mouser.co.uk/ProductDetail/Panasonic/ERJ-2RKF4702X?qs=YMBIwoNQYdXNvWEgS7s3Nw%3D%3D; Arrow Part Number: ERJ-2RKF4702X; Arrow Price/Stock: https://www.arrow.com/en/products/erj-2rkf4702x/panasonic
14 = MLP2012H2R2MT0S1: Inductor; Manufacturer_Name: TDK; Datasheet Link: https://product.tdk.com/system/files/dam/doc/product/inductor/inductor/smd/catalog/inductor_commercial_power_mlp2012_en.pdf; Height: 1.05mm; Manufacturer_Part_Number: MLP2012H2R2MT0S1; Mouser Part Number: 810-MLP2012H2R2MT0S1; Mouser Price/Stock: https://www.mouser.co.uk/ProductDetail/TDK/MLP2012H2R2MT0S1?qs=%2FPzWLGNeQ%252BgQ1f6yrO9reg%3D%3D; Arrow Part Number: MLP2012H2R2MT0S1; Arrow Price/Stock: https://www.arrow.com/en/products/mlp2012h2r2mt0s1/tdk
15 = GRM155R71H332KA01J: Capacitor; Manufacturer_Name: Murata Electronics; Datasheet Link: https://datasheet.datasheetarchive.com/originals/distributors/Datasheets_SAMA/ec4f1577dddcc7a13ddad897a28002d3.pdf; Height: 0.55mm; Manufacturer_Part_Number: GRM155R71H332KA01J; Mouser Part Number: 81-GRM155R71H332KA1J; Mouser Price/Stock: https://www.mouser.com/Search/Refine.aspx?Keyword=81-GRM155R71H332KA1J
C1-C3 C6 C7 C9 C20 C70 C71 C73 C74 = C1005C0G1H470F050BA: Capacitor; Manufacturer_Name: TDK; Datasheet Link: https://product.tdk.com/system/files/dam/doc/product/capacitor/ceramic/mlcc/catalog/mlcc_commercial_general_en.pdf; Height: 0.55mm; Manufacturer_Part_Number: C1005C0G1H470F050BA; Mouser Part Number: 810-C1005C0G1H470F; Mouser Price/Stock: https://www.mouser.com/Search/Refine.aspx?Keyword=810-C1005C0G1H470F
C4 C5 C10 C12 C13 C21 C22 = GRM155R71C104KA88D: Capacitor; Manufacturer_Name: Murata Electronics; Datasheet Link: https://datasheet.datasheetarchive.com/originals/distributors/Datasheets_SAMA/ec4f1577dddcc7a13ddad897a28002d3.pdf; Height: 0.55mm; Manufacturer_Part_Number: GRM155R71C104KA88D; Mouser Part Number: N/A; Arrow Part Number: GRM155R71C104KA88D; Arrow Price/Stock: https://www.arrow.com/en/products/grm155r71c104ka88d/murata-manufacturing?region=nac
C8 C27 C30 C33 C34 C42 C47 C49 C51 C52 C55 C56 C60 C63-C65 C68 C72 = C0603C104K5RACTU: Capacitor; Manufacturer_Name: Kemet; Datasheet Link: http://www.farnell.com/datasheets/2205446.pdf; Height: 0.95mm; Manufacturer_Part_Number: C0603C104K5RACTU; Mouser Part Number: 80-C0603C104K5R; Mouser Price/Stock: https://www.mouser.co.uk/ProductDetail/KEMET/C0603C104K5RACTU?qs=l5k%252BbMnNDkkVcnZPSAaaiQ%3D%3D; Arrow Part Number: C0603C104K5RACTU; Arrow Price/Stock: https://www.arrow.com/en/products/c0603c104k5ractu/kemet-corporation?region=nac
C11 C41 C43 C48 C53 C54 C57 C61 C62 C69 = GMK107BJ105KA-T: Capacitor; Manufacturer_Name: TAIYO YUDEN; Datasheet Link: https://datasheet.datasheetarchive.com/originals/distributors/Datasheets-DGA10/2404957.pdf; Height: 0.9mm; Manufacturer_Part_Number: GMK107BJ105KA-T; Mouser Part Number: 963-GMK107BJ105KA-T; Mouser Price/Stock: https://www.mouser.co.uk/ProductDetail/Taiyo-Yuden/GMK107BJ105KA-T?qs=I6KAKw0tg2ykHAqS8PSP9Q%3D%3D
C14-C17 C23-C26 C35-C38 = C0805C106K8PACTU: Capacitor; Manufacturer_Name: Kemet; Datasheet Link: https://www.arrow.com/en/products/c0805c106k8pactu/kemet-corporation; Height: 1.4mm; Manufacturer_Part_Number: C0805C106K8PACTU; Mouser Part Number: 80-C0805C106K8P; Mouser Price/Stock: https://www.mouser.co.uk/ProductDetail/KEMET/C0805C106K8PACTU?qs=Zpyg6gQUYs39C21BeavaKA%3D%3D; Arrow Part Number: C0805C106K8PACTU; Arrow Price/Stock: https://www.arrow.com/en/products/c0805c106k8pactu/kemet-corporation
C18 C19 = CC0805JRNPO9BN120: Capacitor; Manufacturer_Name: YAGEO (PHYCOMP); Datasheet Link: https://www.mouser.com/datasheet/2/447/UPY-GP_NP0_16V-to-50V_16-1109089.pdf; Height: 0.7mm; Manufacturer_Part_Number: CC0805JRNPO9BN120; Mouser Part Number: 603-CC805JRNPO9BN120; Mouser Price/Stock: https://www.mouser.co.uk/ProductDetail/YAGEO/CC0805JRNPO9BN120?qs=AgBp2OyFlx%252ByU%252BlCha9FzQ%3D%3D; Arrow Part Number: CC0805JRNPO9BN120; Arrow Price/Stock: https://www.arrow.com/en/products/cc0805jrnpo9bn120/yageo
C28 = CL21C330JBANNNC: Capacitor; Manufacturer_Name: Samsung Electro-Mechanics; Datasheet Link: http://product.samsungsem.com/mlcc/CL21C330JBANNW.do; Height: 0.75mm; Manufacturer_Part_Number: CL21C330JBANNNC
C29 = CL21C180JBANNNC: Capacitor; Manufacturer_Name: Samsung Electro-Mechanics; Datasheet Link: https://datasheet.datasheetarchive.com/originals/distributors/Datasheets_SAMA/704d9ee6c0360fd977a3c31d735d98ca.pdf; Height: 1.35mm; Manufacturer_Part_Number: CL21C180JBANNNC; Arrow Part Number: CL21C180JBANNNC; Arrow Price/Stock: https://www.arrow.com/en/products/cl21c180jbannnc/samsung-electro-mechanics
C31 C32 C50 = C0603C475K8PACTU: Capacitor; Manufacturer_Name: Kemet; Datasheet Link: http://componentsearchengine.com/Datasheets/1/C0603C475K8PACTU.pdf; Manufacturer_Part_Number: C0603C475K8PACTU; Mouser Part Number: 80-C0603C475K8P; Mouser Price/Stock: https://www.mouser.co.uk/ProductDetail/KEMET/C0603C475K8PACTU?qs=K%2Fj%2Fqf%252B0fqK6lAUxhlPmKA%3D%3D; Arrow Part Number: C0603C475K8PACTU; Arrow Price/Stock: https://www.arrow.com/en/products/c0603c475k8pactu/kemet-corporation
C39 C40 = C0603C0G1H680K030BA: Capacitor; Manufacturer_Name: TDK; Datasheet Link: https://product.tdk.com/system/files/dam/doc/product/capacitor/ceramic/mlcc/catalog/mlcc_commercial_general_en.pdf; Height: 0.33mm; Manufacturer_Part_Number: C0603C0G1H680K030BA
C44 = GRM155R61A474KE15J: Capacitor; Manufacturer_Name: Murata Electronics; Datasheet Link: https://datasheet.datasheetarchive.com/originals/distributors/Datasheets_SAMA/ec4f1577dddcc7a13ddad897a28002d3.pdf; Height: 0.55mm; Manufacturer_Part_Number: GRM155R61A474KE15J; Mouser Part Number: 81-GRM155R61A474KE5J; Mouser Price/Stock: https://www.mouser.co.uk/ProductDetail/Murata-Electronics/GRM155R61A474KE15J?qs=vlRPwuE0P7lseeNiDfG%252BAQ%3D%3D; Arrow Part Number: GRM155R61A474KE15J; Arrow Price/Stock: https://www.arrow.com/en/products/grm155r61a474ke15j/murata-manufacturing
C45 C46 = GRM1555C1H270JA01D: Capacitor; Manufacturer_Name: Murata Electronics; Datasheet Link: https://datasheet.datasheetarchive.com/originals/distributors/Datasheets_SAMA/ec4f1577dddcc7a13ddad897a28002d3.pdf; Height: 0.55mm; Manufacturer_Part_Number: GRM1555C1H270JA01D; Mouser Part Number: 81-GRM1555C1H270JA1D; Mouser Price/Stock: https://www.mouser.co.uk/ProductDetail/Murata-Electronics/GRM1555C1H270JA01D?qs=4k9rjS6ZRl6bZIQOxCwSeQ%3D%3D; Arrow Part Number: GRM1555C1H270JA01D; Arrow Price/Stock: https://www.arrow.com/en/products/grm1555c1h270ja01d/murata-manufacturing
C58 C59 C66 C67 = C1608X5R0J226M080AC: Capacitor; Manufacturer_Name: TDK; Datasheet Link: https://product.tdk.com/system/files/dam/doc/product/capacitor/ceramic/mlcc/catalog/mlcc_commercial_general_en.pdf; Height: 0.9mm; Manufacturer_Part_Number: C1608X5R0J226M080AC; Mouser Part Number: 810-C1608X5R0J226M; Mouser Price/Stock: https://www.mouser.co.uk/ProductDetail/TDK/C1608X5R0J226M080AC?qs=NRhsANhppD%2FZwGFVoUm6mQ%3D%3D; Arrow Part Number: C1608X5R0J226M080AC; Arrow Price/Stock: https://www.arrow.com/en/products/c1608x5r0j226m080ac/tdk
C75 = C1005C0G1H221J050BA: Capacitor; Manufacturer_Name: TDK; Datasheet Link: https://product.tdk.com/system/files/dam/doc/product/capacitor/ceramic/mlcc/catalog/mlcc_commercial_general_en.pdf; Height: 0.55mm; Manufacturer_Part_Number: C1005C0G1H221J050BA; Mouser Part Number: 810-C1005C0G1H221J; Mouser Price/Stock: https://www.mouser.co.uk/ProductDetail/TDK/C1005C0G1H221J050BA?qs=NRhsANhppD8YJPnzB6uXvQ%3D%3D; Arrow Part Number: C1005C0G1H221J050BA; Arrow Price/Stock: https://www.arrow.com/en/products/c1005c0g1h221j050ba/tdk
FB1 = BLM41PG102SN1L: Ferrite Bead; Manufacturer_Name: Murata Electronics; Datasheet Link: https://www.murata.com/en-us/products/productdetail?partno=BLM41PG102SN1%23; Height: 1.8mm; Manufacturer_Part_Number: BLM41PG102SN1L; Mouser Part Number: 81-BLM41PG102SN1L; Mouser Price/Stock: https://www.mouser.co.uk/ProductDetail/Murata-Electronics/BLM41PG102SN1L?qs=%252Bi%252B2JQhhbn3KYzONFOUA%2Fg%3D%3D; Arrow Part Number: BLM41PG102SN1L; Arrow Price/Stock: https://www.arrow.com/en/products/blm41pg102sn1l/murata-manufacturing
FL1 = BLM21AG121SN1D: Filter; Manufacturer_Name: Murata Electronics; Datasheet Link: https://www.murata.com/en-us/products/productdetail?partno=BLM21AG121SN1%23; Height: 1.05mm; Manufacturer_Part_Number: BLM21AG121SN1D; Mouser Part Number: 81-BLM21AG121SN1D; Mouser Price/Stock: https://www.mouser.co.uk/ProductDetail/Murata-Electronics/BLM21AG121SN1D/?qs=Yx1HeqtvVDh3I5YNpjdt%252BQ%3D%3D; Arrow Part Number: BLM21AG121SN1D; Arrow Price/Stock: https://www.arrow.com/en/products/blm21ag121sn1d/murata-manufacturing?region=europe
IC1 = FT230XS-R: Integrated Circuit; Manufacturer_Name: FTDI Chip; Datasheet Link: http://www.ftdichip.com/Support/Documents/DataSheets/ICs/DS_FT230X.pdf; Height: 1.753mm; Manufacturer_Part_Number: FT230XS-R; Mouser Part Number: 895-FT230XS-R; Mouser Price/Stock: https://www.mouser.co.uk/ProductDetail/FTDI/FT230XS-R?qs=Gp1Yz1mis3XyCLeYOseSng%3D%3D; Arrow Part Number: FT230XS-R; Arrow Price/Stock: http://www.arrow.com/en/products/ft230xs-r/ftdi-chip
IC2 IC4 IC6 = NL27WZ07DFT2G: Integrated Circuit; Manufacturer_Name: ON Semiconductor; Datasheet Link: https://www.onsemi.com/pdf/datasheet/nl27wz07-d.pdf; Height: 1.1mm; Manufacturer_Part_Number: NL27WZ07DFT2G; Mouser Part Number: 863-NL27WZ07DFT2G; Mouser Price/Stock: https://www.mouser.com/Search/Refine.aspx?Keyword=863-NL27WZ07DFT2G; Arrow Part Number: NL27WZ07DFT2G; Arrow Price/Stock: https://www.arrow.com/en/products/nl27wz07dft2g/on-semiconductor?region=nac
IC3 IC16 = MAX13202EALT+: Integrated Circuit; Manufacturer_Name: Maxim Integrated; Datasheet Link: https://pdfserv.maximintegrated.com/en/ds/MAX13202E-MAX13208E.pdf; Height: 0.8mm; Manufacturer_Part_Number: MAX13202EALT+
IC5 = MAX6816EUS+T: Integrated Circuit; Manufacturer_Name: Maxim Integrated; Datasheet Link: http://datasheets.maximintegrated.com/en/ds/MAX6816-MAX6818.pdf; Height: 1.22mm; Manufacturer_Part_Number: MAX6816EUS+T; Mouser Part Number: 700-MAX6816EUST; Mouser Price/Stock: https://www.mouser.co.uk/ProductDetail/Maxim-Integrated/MAX6816EUS%2bT?qs=1THa7WoU59EAx6vXEummCg%3D%3D
IC7-IC10 IC13 IC14 = TPS62060DSGR: Integrated Circuit; Manufacturer_Name: Texas Instruments; Datasheet Link: http://www.ti.com/lit/gpn/TPS62060; Height: 0.8mm; Manufacturer_Part_Number: TPS62060DSGR; Mouser Part Number: 595-TPS62060DSGR; Mouser Price/Stock: https://www.mouser.co.uk/ProductDetail/Texas-Instruments/TPS62060DSGR?qs=%2Fqzd9s%252BcLd7NphHetRHQZQ%3D%3D; Arrow Part Number: TPS62060DSGR; Arrow Price/Stock: https://www.arrow.com/en/products/tps62060dsgr/texas-instruments
IC11 = MAX4948ETG+: Integrated Circuit; Manufacturer_Name: Maxim Integrated; Datasheet Link: https://datasheets.maximintegrated.com/en/ds/MAX4947-MAX4948.pdf; Height: 0.8mm; Manufacturer_Part_Number: MAX4948ETG+; Mouser Part Number: 700-MAX4948ETG; Mouser Price/Stock: https://www.mouser.co.uk/ProductDetail/Maxim-Integrated/MAX4948ETG%2b/?qs=LHmEVA8xxfa3Nwt5cul%252BwA%3D%3D
IC12 = FT4222HQ-D-R: Integrated Circuit; Manufacturer_Name: FTDI Chip; Datasheet Link: https://www.ftdichip.com/Support/Documents/DataSheets/ICs/DS_FT4222H.pdf; Height: 0.9mm; Manufacturer_Part_Number: FT4222HQ-D-R; Mouser Part Number: 895-FT4222HQ-D-R; Mouser Price/Stock: https://www.mouser.co.uk/ProductDetail/FTDI/FT4222HQ-D-R?qs=F5EMLAvA7ICA8wBdrr3fuQ%3D%3D; Arrow Part Number: FT4222HQ-D-R; Arrow Price/Stock: https://www.arrow.com/en/products/ft4222hq-d-r/ftdi-chip?region=nac
IC15 = MAX13202EALT+T: Integrated Circuit; Manufacturer_Name: Maxim Integrated; Datasheet Link: https://pdfserv.maximintegrated.com/en/ds/MAX13202E-MAX13208E.pdf; Height: 0.8mm; Manufacturer_Part_Number: MAX13202EALT+T; Mouser Part Number: 700-MAX13202EALTT; Mouser Price/Stock: https://www.mouser.co.uk/ProductDetail/Maxim-Integrated/MAX13202EALT%2bT?qs=8wHch9UpSvYWK1vZ7ylxSw%3D%3D
IC17 = IS25LP128-JBLE: Integrated Circuit; Manufacturer_Name: Integrated Silicon Solution Inc.; Datasheet Link: https://datasheet.datasheetarchive.com/originals/distributors/DKDS-13/254838.pdf; Height: 2.16mm; Manufacturer_Part_Number: IS25LP128-JBLE; Mouser Part Number: 870-IS25LP128-JBLE; Mouser Price/Stock: https://www.mouser.co.uk/ProductDetail/ISSI/IS25LP128-JBLE?qs=rnuWwpjhhVunvfx8GxnhmA%3D%3D; Arrow Part Number: IS25LP128-JBLE; Arrow Price/Stock: https://www.arrow.com/en/products/is25lp128-jble/integrated-silicon-solution-inc
IC18 = SPH0645LM4H-1-8: Integrated Circuit; Manufacturer_Name: Knowles; Datasheet Link: https://www.knowles.com/docs/default-source/default-document-library/sph0645lm4h-1-datasheet.pdf?Status=Master&sfvrsn=751076b1_2; Height: 1.08mm; Manufacturer_Part_Number: SPH0645LM4H-1-8; Mouser Part Number: 721-SPH0645LM4H-1-8; Mouser Price/Stock: https://www.mouser.co.uk/ProductDetail/Knowles/SPH0645LM4H-1-8?qs=TuK3vfAjtkXP9L009Fh60A%3D%3D
J1 J2 J5 = PEC04DAAN: Connector; Manufacturer_Name: Sullins; Datasheet Link: https://drawings-pdf.s3.amazonaws.com/C10419.pdf; Height: 8.38mm; Manufacturer_Part_Number: PEC04DAAN
J3 = PEC02SAAN: Connector; Manufacturer_Name: Sullins; Datasheet Link: https://s3.amazonaws.com/catalogspreads-pdf/PAGE112-113%20.100%20MALE%20HDR.pdf; Height: 8.38mm; Manufacturer_Part_Number: PEC02SAAN
J4 J11 = 47346-0001: Connector; Manufacturer_Name: Molex; Datasheet Link: http://www.molex.com/pdm_docs/sd/473460001_sd.pdf; Manufacturer_Part_Number: 47346-0001; Mouser Part Number: 538-47346-0001; Mouser Price/Stock: https://www.mouser.co.uk/ProductDetail/Molex/47346-0001?qs=c2CV6XM0DweJBWaSeyWeCw%3D%3D
J6 = PEC05SAAN: Connector; Manufacturer_Name: Sullins; Datasheet Link: https://s3.amazonaws.com/catalogspreads-pdf/PAGE112-113%20.100%20MALE%20HDR.pdf; Height: 8.58mm; Manufacturer_Part_Number: PEC05SAAN
J7 J8 = 3220-10-0300-00-TR: Connector; Manufacturer_Name: CNC Tech; Datasheet Link: http://www.cnctech.us/pdfs/3220-XX-0300-00-TR.pdf; Height: 5.55mm; Manufacturer_Part_Number: 3220-10-0300-00-TR; Arrow Part Number: 3220-10-0300-00-TR; Arrow Price/Stock: https://www.arrow.com/en/products/3220-10-0300-00-tr/cnc-tech-llc?region=nac
J9 = SSW-124-01-T-S: Connector; Manufacturer_Name: SAMTEC; Datasheet Link: http://suddendocs.samtec.com/prints/ssw-1xx-xx-xxx-x-xx-xxx-xx-mkt.pdf; Manufacturer_Part_Number: SSW-124-01-T-S; Mouser Part Number: 200-SSW12401TS
J12 J13 = PEC03SAAN: Connector; Manufacturer_Name: Sullins; Datasheet Link: https://s3.amazonaws.com/catalogspreads-pdf/PAGE112-113%20.100%20MALE%20HDR.pdf; Height: 8.38mm; Manufacturer_Part_Number: PEC03SAAN
J14 = M52-5050545: Connector; Manufacturer_Name: Harwin; Datasheet Link: https://cdn.harwin.com/pdfs/M52-505.pdf; Height: 5.7mm; Manufacturer_Part_Number: M52-5050545; Mouser Part Number: 855-M52-5050545; Mouser Price/Stock: https://www.mouser.co.uk/ProductDetail/Harwin/M52-5050545?qs=%252Bk6%2F5FB6qrk5mVrIdNiYzQ%3D%3D
L1-L6 = IHLP2020CZER1R0M8A: Inductor; Manufacturer_Name: Vishay; Datasheet Link: https://www.vishay.com/docs/34563/ihlp-2020cz-8a.pdf; Height: 3mm; Manufacturer_Part_Number: IHLP2020CZER1R0M8A; Mouser Part Number: 70-IHLP2020CZR1R0M8A; Mouser Price/Stock: https://www.mouser.co.uk/ProductDetail/Vishay-Dale/IHLP2020CZER1R0M8A?qs=DRkmTr78QAQbvJic74K0Vg%3D%3D
LED1 = HSMR-C150: LED; Manufacturer_Name: Avago Technologies; Datasheet Link: https://componentsearchengine.com/Datasheets/2/HSMR-C150.pdf; Height: 1.2mm; Manufacturer_Part_Number: HSMR-C150; Mouser Part Number: 630-HSMR-C150; Mouser Price/Stock: https://www.mouser.co.uk/ProductDetail/Broadcom-Avago/HSMR-C150?qs=YDL0qNrpDT5KBl5KNuuRTw%3D%3D
MAX1 = MAX78000EXG+: Integrated Circuit; Manufacturer_Name: Maxim Integrated; Datasheet Link: https://pdfserv.maximintegrated.com/en/ds/MAX78000.pdf; Height: 1.3mm; Manufacturer_Part_Number: MAX78000EXG+; Mouser Part Number: 700-MAX78000EXG+; Mouser Price/Stock: https://www.mouser.co.uk/ProductDetail/Maxim-Integrated/MAX78000EXG%2b?qs=yqaQSyyJnNigS5t%2FKz0nhQ%3D%3D
P1 = Header 10X2: Header, 10-Pin, Dual row; LatestRevisionDate: 17-Jul-2002; LatestRevisionNote: Re-released for DXP Platform.; Publisher: Altium Limited
R1 R2 = ERJ-2RKF4992X: Resistor; Manufacturer_Name: Panasonic; Datasheet Link: http://industrial.panasonic.com/cdbs/www-data/pdf/RDA0000/AOA0000C304.pdf; Height: 0.4mm; Manufacturer_Part_Number: ERJ-2RKF4992X; Mouser Part Number: 667-ERJ-2RKF4992X; Mouser Price/Stock: https://www.mouser.co.uk/ProductDetail/Panasonic/ERJ-2RKF4992X/?qs=1iN9QGIZ5R%252Bb2pvOGnid7w%3D%3D; Arrow Part Number: ERJ-2RKF4992X; Arrow Price/Stock: https://www.arrow.com/en/products/erj-2rkf4992x/panasonic
R3 R5 = ERJ-2RKF27R0X: Resistor; Manufacturer_Name: Panasonic; Datasheet Link: http://industrial.panasonic.com/cdbs/www-data/pdf/RDA0000/AOA0000C304.pdf; Height: 0.4mm; Manufacturer_Part_Number: ERJ-2RKF27R0X; Mouser Part Number: 667-ERJ-2RKF27R0X; Mouser Price/Stock: https://www.mouser.co.uk/ProductDetail/Panasonic/ERJ-2RKF27R0X?qs=YMBIwoNQYdXRmpDlurxRVg%3D%3D; Arrow Part Number: ERJ-2RKF27R0X; Arrow Price/Stock: https://www.arrow.com/en/products/erj-2rkf27r0x/panasonic
R4 = ERJ3EKF2701V: Resistor; Manufacturer_Name: Panasonic; Datasheet Link: https://industrial.panasonic.com/cdbs/www-data/pdf/RDA0000/AOA0000C304.pdf; Height: 0.55mm; Manufacturer_Part_Number: ERJ3EKF2701V
R6 R7 = RT0805BRD07111KL: Resistor; Manufacturer_Name: YAGEO (PHYCOMP); Datasheet Link: https://componentsearchengine.com/Datasheets/1/RT0805BRD07111KL.pdf; Height: 0.6mm; Manufacturer_Part_Number: RT0805BRD07111KL; Mouser Part Number: 603-RT0805BRD07111KL; Mouser Price/Stock: https://www.mouser.co.uk/ProductDetail/Yageo/RT0805BRD07111KL?qs=bQfrgN9vNvxW8OaJGLTFCQ%3D%3D; Arrow Part Number: RT0805BRD07111KL; Arrow Price/Stock: https://www.arrow.com/en/products/rt0805brd07111kl/yageo
R8 R9 = CRCW0402499KFKED: Resistor; Manufacturer_Name: Vishay; Datasheet Link: http://www.vishay.com/docs/20035/dcrcwe3.pdf; Height: 0.4mm; Manufacturer_Part_Number: CRCW0402499KFKED; Mouser Part Number: 71-CRCW0402-499K-E3; Mouser Price/Stock: https://www.mouser.co.uk/ProductDetail/Vishay-Dale/CRCW0402499KFKED?qs=hAuyw6LW%252BLiJEa%252B3vtZI3Q%3D%3D
R10 = CRCW0402102KFKED: Resistor; Manufacturer_Name: Vishay; Datasheet Link: http://www.vishay.com/docs/20035/dcrcwe3.pdf; Height: 0.4mm; Manufacturer_Part_Number: CRCW0402102KFKED; Mouser Part Number: 71-CRCW0402-102K-E3; Mouser Price/Stock: https://www.mouser.co.uk/ProductDetail/Vishay-Dale/CRCW0402102KFKED?qs=rlE3Te1NifwphdA8fQQlsA%3D%3D; Arrow Part Number: CRCW0402102KFKED; Arrow Price/Stock: https://www.arrow.com/en/products/crcw0402102kfked/vishay
R11 R15-R17 = CRCW0402100KFKED: Resistor; Manufacturer_Name: Vishay; Datasheet Link: http://www.vishay.com/docs/20035/dcrcwe3.pdf; Height: 0.4mm; Manufacturer_Part_Number: CRCW0402100KFKED; Mouser Part Number: 71-CRCW0402-100K-E3; Mouser Price/Stock: https://www.mouser.co.uk/ProductDetail/Vishay-Dale/CRCW0402100KFKED?qs=OlqPY1CiralZGKRwQ4Glcg%3D%3D; Arrow Part Number: CRCW0402100KFKED; Arrow Price/Stock: https://www.arrow.com/en/products/crcw0402100kfked/vishay
R12 = CRCW0402200KFKED: Resistor; Manufacturer_Name: Vishay; Datasheet Link: http://www.vishay.com/docs/20035/dcrcwe3.pdf; Height: 0.4mm; Manufacturer_Part_Number: CRCW0402200KFKED; Mouser Part Number: 71-CRCW0402-200K-E3; Mouser Price/Stock: https://www.mouser.com/Search/Refine.aspx?Keyword=71-CRCW0402-200K-E3; Arrow Part Number: CRCW0402200KFKED; Arrow Price/Stock: https://www.arrow.com/en/products/crcw0402200kfked/vishay
R13 = CRCW0402374KFKED: Resistor; Manufacturer_Name: Vishay; Datasheet Link: http://www.vishay.com/docs/20035/dcrcwe3.pdf; Height: 0.4mm; Manufacturer_Part_Number: CRCW0402374KFKED; Mouser Part Number: 71-CRCW0402-374K-E3; Mouser Price/Stock: https://www.mouser.co.uk/ProductDetail/Vishay-Dale/CRCW0402374KFKED?qs=1XGAtBqYNz57mwAP8KKAqw%3D%3D; Arrow Part Number: CRCW0402374KFKED; Arrow Price/Stock: https://www.arrow.com/en/products/crcw0402374kfked/vishay
R14 = RC0603FR-07120KL: Resistor; Manufacturer_Name: YAGEO (PHYCOMP); Datasheet Link: https://datasheet.datasheetarchive.com/originals/distributors/Datasheets_SAMA/902f9e387b938f871d31120f5fc1d65e.pdf; Height: 0.55mm; Manufacturer_Part_Number: RC0603FR-07120KL; Mouser Part Number: 603-RC0603FR-07120KL; Mouser Price/Stock: https://www.mouser.co.uk/ProductDetail/YAGEO/RC0603FR-07120KL?qs=IuGqVx9wL0JtpsOJLI%252BszA%3D%3D; Arrow Part Number: RC0603FR-07120KL; Arrow Price/Stock: https://www.arrow.com/en/products/rc0603fr-07120kl/yageo?region=europe
R18 = ERJ-2RKF1004X: Resistor; Manufacturer_Name: Panasonic; Datasheet Link: http://industrial.panasonic.com/cdbs/www-data/pdf/RDA0000/AOA0000C304.pdf; Height: 0.4mm; Manufacturer_Part_Number: ERJ-2RKF1004X; Mouser Part Number: 667-ERJ-2RKF1004X; Mouser Price/Stock: https://www.mouser.co.uk/ProductDetail/Panasonic/ERJ-2RKF1004X?qs=H7k1u0Mp9JTG%252BclS6LVdqw%3D%3D; Arrow Part Number: ERJ-2RKF1004X; Arrow Price/Stock: https://www.arrow.com/en/products/erj-2rkf1004x/panasonic
R19 = ERJ-2RKF33R2X: Resistor; Manufacturer_Name: Panasonic; Datasheet Link: http://industrial.panasonic.com/cdbs/www-data/pdf/RDA0000/AOA0000C304.pdf; Height: 0.4mm; Manufacturer_Part_Number: ERJ-2RKF33R2X; Mouser Part Number: 667-ERJ-2RKF33R2X; Mouser Price/Stock: https://www.mouser.com/Search/Refine.aspx?Keyword=667-ERJ-2RKF33R2X
S1-S4 = B3S-1000P: Switch; Manufacturer_Name: Omron Electronics; Datasheet Link: https://omronfs.omron.com/en_US/ecb/products/pdf/en-b3s.pdf; Height: 4.7mm; Manufacturer_Part_Number: B3S-1000P; Mouser Part Number: 653-B3S-1000P; Mouser Price/Stock: https://www.mouser.co.uk/ProductDetail/Omron-Electronics/B3S-1000P?qs=VO24nqdQNUCU2XaZiLnzsQ%3D%3D; Arrow Part Number: B3S-1000P; Arrow Price/Stock: https://www.arrow.com/en/products/b3s1000p/omron?region=nac
Y1 = ABM3-12.000MHZ-D2Y-T: Crystal or Oscillator; Manufacturer_Name: ABRACON; Datasheet Link: https://abracon.com/Resonators/abm3.pdf; Height: 1mm; Manufacturer_Part_Number: ABM3-12.000MHZ-D2Y-T; Mouser Part Number: 815-ABM3-12-D2Y-T; Mouser Price/Stock: https://www.mouser.co.uk/ProductDetail/ABRACON/ABM3-12000MHZ-D2Y-T?qs=ihRgKfnEsN4a%252Bhdo6LkcSg%3D%3D; Arrow Part Number: ABM3-12.000MHZ-D2Y-T; Arrow Price/Stock: https://www.arrow.com/en/products/abm3-12.000mhz-d2y-t/abracon
Y2 = SG-210STF_12.2880ML3: Crystal or Oscillator; Manufacturer_Name: Epson Timing; Manufacturer_Part_Number: SG-210STF 12.2880ML3; Datasheet Link: https://support.epson.biz/td/api/doc_check.php?dl=brief_SG-210STF&lang=en; Height: 0.9mm; Mouser Part Number: 732-SG210STF12.288L3; Mouser Price/Stock: https://www.mouser.co.uk/ProductDetail/Epson-Timing/SG-210STF-122880ML3?qs=6J2kD0vu%2F2VMSmlKNtfCoQ%3D%3D; Arrow Part Number: SG-210STF 12.2880ML3; Arrow Price/Stock: https://www.arrow.com/en/products/sg-210stf12.2880ml3/epson-electronics-america
Y3 = ABS07-32.768KHZ-6-T: Crystal or Oscillator; Manufacturer_Name: ABRACON; Datasheet Link: https://abracon.com/Resonators/ABS07-LR.pdf; Height: 0.9mm; Manufacturer_Part_Number: ABS07-32.768KHZ-6-T; Mouser Part Number: 815-ABS07-32.768K6T; Mouser Price/Stock: https://www.mouser.co.uk/ProductDetail/ABRACON/ABS07-32768KHZ-6-T?qs=Pyu0ZBy%2FIJYqrd93qMRCiw%3D%3D; Arrow Part Number: ABS07-32.768KHZ-6-T; Arrow Price/Stock: https://www.arrow.com/en/products/abs07-32.768khz-6-t/abracon?region=nac